# Altium project MB672.PrjPCB (part 1 of 2)
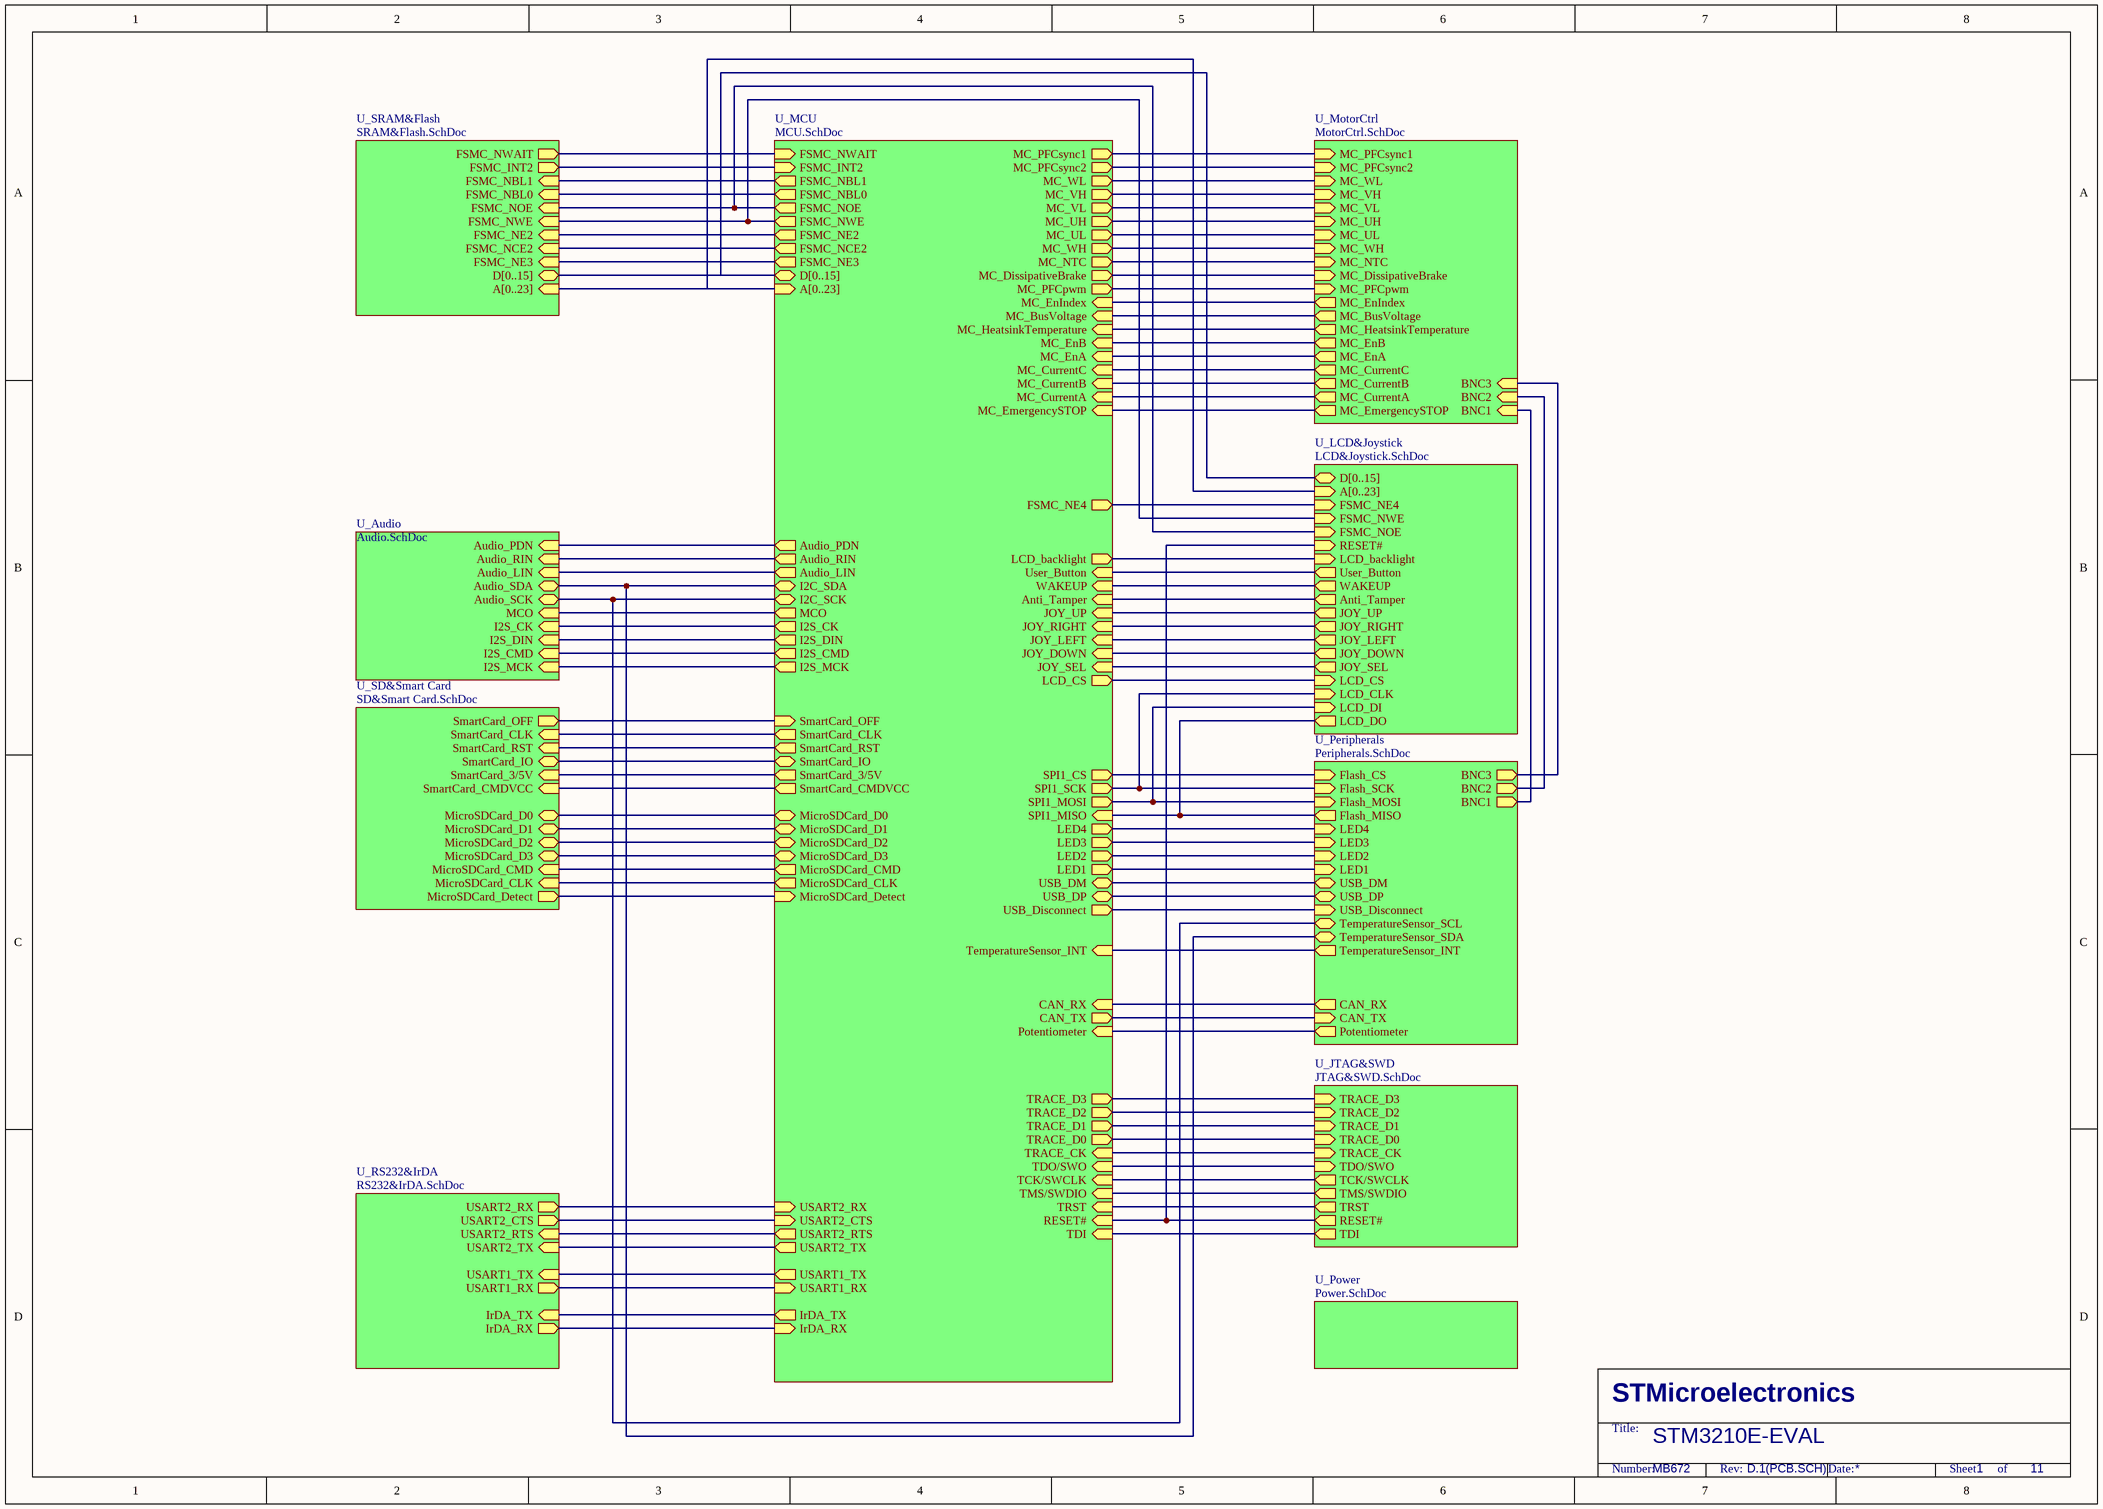
[diagram p0: MB672.SchDoc]
11 sheets, 337 parts. Net scope: hierarchical (ports join the sheet entries above them; power ports are global).
Board file: MB672.PCBDOC
Sheets:
  MB672.SchDoc
    U_Audio = Audio.SchDoc
    U_SRAM&Flash = SRAM&Flash.SchDoc
    U_RS232&IrDA = RS232&IrDA.SchDoc
    U_Peripherals = Peripherals.SchDoc
    U_MotorCtrl = MotorCtrl.SchDoc
    U_Power = Power.SchDoc
    U_JTAG&SWD = JTAG&SWD.SchDoc
    U_MCU = MCU.SchDoc
    U_SD&Smart Card = SD&Smart Card.SchDoc
    U_LCD&Joystick = LCD&Joystick.SchDoc

## Sheet MB672.SchDoc
size A3; Revision: D.1(PCB.SCH)

### Sub-sheets
U_Audio = Audio.SchDoc: I2S_CMD (in), I2S_DIN (in), I2S_CK (in), MCO (in), Audio_SCK (bidir), Audio_SDA (bidir), Audio_LIN (in), Audio_RIN (in), I2S_MCK (in), Audio_PDN (in)
U_JTAG&SWD = JTAG&SWD.SchDoc: TDI (out), RESET# (out), TRACE_D3 (in), TRACE_D2 (in), TRACE_D1 (in), TRACE_D0 (in), TRACE_CK (in), TRST (out), TMS/SWDIO (out), TCK/SWCLK (out), TDO/SWO (in)
U_LCD&Joystick = LCD&Joystick.SchDoc: JOY_SEL (out), JOY_DOWN (out), JOY_LEFT (out), JOY_RIGHT (out), JOY_UP (out), LCD_CS (in), LCD_CLK (in), LCD_DI (in), RESET# (in), LCD_backlight (in), Anti_Tamper (out), WAKEUP (out), User_Button (out), FSMC_NE4 (in), D[0..15] (bidir), A[0..23] (in), FSMC_NWE (in), FSMC_NOE (in), LCD_DO (out)
U_MCU = MCU.SchDoc: TDI (in), TRACE_CK (in), TMS/SWDIO (in), TCK/SWCLK (in), TDO/SWO (in), USART2_RX (in), USART2_TX (out), USART2_RTS (out), USART2_CTS (in), USART1_TX (out), USART1_RX (in), IrDA_RX (in), IrDA_TX (out), MC_EmergencySTOP (in), MC_CurrentA (in), MC_CurrentB (in), MC_CurrentC (in), MC_PFCsync1 (out), MC_PFCsync2 (out), MC_WL (out), MC_VH (out), MC_VL (out), MC_UH (out), MC_UL (out), MC_WH (out), MC_NTC (out), MC_DissipativeBrake (out), MC_PFCpwm (out), MC_EnA (in), MC_EnB (in), MC_HeatsinkTemperature (in), MC_BusVoltage (in), MC_EnIndex (in), JOY_SEL (in), JOY_DOWN (in), JOY_LEFT (in), JOY_RIGHT (in), JOY_UP (in), LCD_CS (out), LCD_backlight (out), Anti_Tamper (in), WAKEUP (in), User_Button (in), SPI1_CS (out), SPI1_SCK (out), SPI1_MISO (in), SPI1_MOSI (out), LED4 (out), LED3 (out), LED1 (out), LED2 (out), USB_DM (bidir), USB_DP (bidir), USB_Disconnect (out), TemperatureSensor_INT (in), CAN_TX (out), CAN_RX (in), Potentiometer (in), FSMC_NE3 (out), A[0..23] (in), D[0..15] (bidir), FSMC_NE4 (out), FSMC_NCE2 (out), FSMC_NE2 (out), FSMC_NWE (out), FSMC_NOE (out), FSMC_NBL0 (out), FSMC_NBL1 (out), FSMC_NWAIT (in), FSMC_INT2 (in), MicroSDCard_CLK (out), MicroSDCard_CMD (out), SmartCard_3/5V (out), SmartCard_IO (bidir), SmartCard_RST (out), SmartCard_CLK (out), SmartCard_OFF (in), SmartCard_CMDVCC (out), MicroSDCard_D0 (bidir), I2S_CMD (out), I2S_DIN (out), I2S_CK (out), MCO (out), I2C_SCK (bidir), I2C_SDA (bidir), MicroSDCard_D1 (bidir), MicroSDCard_D2 (bidir), MicroSDCard_D3 (bidir), RESET# (in), TRACE_D3 (out), TRACE_D2 (out), TRACE_D1 (out), TRACE_D0 (out), TRST (in), Audio_LIN (out), Audio_RIN (out), MicroSDCard_Detect (in), I2S_MCK (out), Audio_PDN (out)
U_MotorCtrl = MotorCtrl.SchDoc: MC_EmergencySTOP (out), MC_CurrentA (out), MC_CurrentB (out), MC_CurrentC (out), MC_PFCsync1 (in), MC_PFCsync2 (in), MC_WL (in), MC_VH (in), MC_VL (in), MC_UH (in), MC_UL (in), MC_WH (in), MC_NTC (in), MC_DissipativeBrake (in), MC_PFCpwm (in), MC_EnA (out), MC_EnB (out), MC_HeatsinkTemperature (out), MC_BusVoltage (out), MC_EnIndex (out), BNC1 (in), BNC2 (in), BNC3 (in)
U_Peripherals = Peripherals.SchDoc: Flash_CS (in), Flash_SCK (in), Flash_MISO (out), Flash_MOSI (in), LED4 (in), LED3 (in), LED1 (in), LED2 (in), USB_DM (bidir), USB_DP (bidir), USB_Disconnect (in), TemperatureSensor_INT (out), TemperatureSensor_SCL (bidir), TemperatureSensor_SDA (bidir), BNC1 (out), CAN_TX (in), CAN_RX (out), Potentiometer (out), BNC2 (out), BNC3 (out)
U_Power = Power.SchDoc: no entries
U_RS232&IrDA = RS232&IrDA.SchDoc: USART2_RX (out), USART2_TX (in), USART2_RTS (in), USART2_CTS (out), USART1_TX (in), USART1_RX (out), IrDA_RX (out), IrDA_TX (in)
U_SD&Smart Card = SD&Smart Card.SchDoc: MicroSDCard_CLK (in), MicroSDCard_CMD (in), SmartCard_3/5V (in), SmartCard_IO (bidir), SmartCard_RST (in), SmartCard_CLK (in), SmartCard_OFF (out), SmartCard_CMDVCC (in), MicroSDCard_D0 (bidir), MicroSDCard_D1 (bidir), MicroSDCard_D2 (bidir), MicroSDCard_D3 (bidir), MicroSDCard_Detect (out)
U_SRAM&Flash = SRAM&Flash.SchDoc: A[0..23] (in), D[0..15] (bidir), FSMC_NE3 (in), FSMC_NCE2 (in), FSMC_NE2 (in), FSMC_NWE (in), FSMC_NOE (in), FSMC_NBL0 (in), FSMC_NBL1 (in), FSMC_NWAIT (out), FSMC_INT2 (out)

### Nets
A19: sheet U_JTAG&SWD/TRACE_D0, sheet U_MCU/TRACE_D0
A20: sheet U_JTAG&SWD/TRACE_D1, sheet U_MCU/TRACE_D1
A21: sheet U_JTAG&SWD/TRACE_D2, sheet U_MCU/TRACE_D2
A22: sheet U_JTAG&SWD/TRACE_D3, sheet U_MCU/TRACE_D3
A23: sheet U_JTAG&SWD/TRACE_CK, sheet U_MCU/TRACE_CK
PA0: sheet U_MCU/WAKEUP, sheet U_LCD&Joystick/WAKEUP
PA1: sheet U_RS232&IrDA/USART2_RTS, sheet U_MotorCtrl/MC_EnB, sheet U_MCU/USART2_RTS, sheet U_MCU/MC_EnB
PA2: sheet U_RS232&IrDA/USART2_TX, sheet U_MotorCtrl/MC_EnIndex, sheet U_MCU/USART2_TX, sheet U_MCU/MC_EnIndex
PA4: sheet U_Audio/Audio_RIN, sheet U_MCU/Audio_RIN
PA5: sheet U_Audio/Audio_LIN, sheet U_Peripherals/Flash_SCK, sheet U_MCU/SPI1_SCK, sheet U_MCU/Audio_LIN, sheet U_LCD&Joystick/LCD_CLK
PA6: sheet U_Peripherals/Flash_MISO, sheet U_MCU/SPI1_MISO, sheet U_LCD&Joystick/LCD_DO
PA7: sheet U_Peripherals/Flash_MOSI, sheet U_MotorCtrl/MC_UL, sheet U_MCU/MC_UL, sheet U_MCU/SPI1_MOSI, sheet U_LCD&Joystick/LCD_DI
PA8: sheet U_Audio/MCO, sheet U_MCU/LCD_backlight, sheet U_MCU/MCO, sheet U_LCD&Joystick/LCD_backlight
PA9: sheet U_RS232&IrDA/USART1_TX, sheet U_MCU/USART1_TX
PA10: sheet U_RS232&IrDA/USART1_RX, sheet U_MCU/USART1_RX
PA11: sheet U_Peripherals/USB_DM, sheet U_MCU/USB_DM
PA12: sheet U_Peripherals/USB_DP, sheet U_MCU/USB_DP
PA13: sheet U_JTAG&SWD/TMS/SWDIO, sheet U_MCU/TMS/SWDIO
PA14: sheet U_JTAG&SWD/TCK/SWCLK, sheet U_MCU/TCK/SWCLK
PA15: sheet U_JTAG&SWD/TDI, sheet U_MCU/TDI
PB0: sheet U_MotorCtrl/MC_VL, sheet U_MCU/MC_VL, sheet U_MCU/SmartCard_3/5V, sheet U_SD&Smart Card/SmartCard_3/5V
PB1: sheet U_MotorCtrl/MC_WL, sheet U_MCU/MC_WL
PB2: sheet U_Peripherals/Flash_CS, sheet U_MCU/SPI1_CS
PB3: sheet U_JTAG&SWD/TDO/SWO, sheet U_MCU/TDO/SWO
PB4: sheet U_MotorCtrl/MC_PFCsync1, sheet U_JTAG&SWD/TRST, sheet U_MCU/MC_PFCsync1, sheet U_MCU/TRST
PB5: sheet U_MotorCtrl/MC_PFCpwm, sheet U_MCU/MC_PFCpwm
PB6: sheet U_Audio/Audio_SCK, sheet U_Peripherals/TemperatureSensor_SCL, sheet U_MCU/I2C_SCK
PB7: sheet U_Audio/Audio_SDA, sheet U_Peripherals/TemperatureSensor_SDA, sheet U_MCU/I2C_SDA
PB8: sheet U_Peripherals/CAN_RX, sheet U_MCU/CAN_RX
PB9: sheet U_Peripherals/CAN_TX, sheet U_MCU/CAN_TX
PB10: sheet U_MCU/SmartCard_IO, sheet U_SD&Smart Card/SmartCard_IO
PB11: sheet U_MCU/SmartCard_RST, sheet U_SD&Smart Card/SmartCard_RST
PB12: sheet U_Audio/I2S_CMD, sheet U_MotorCtrl/MC_NTC, sheet U_MCU/MC_NTC, sheet U_MCU/SmartCard_CLK, sheet U_MCU/I2S_CMD, sheet U_SD&Smart Card/SmartCard_CLK
PB13: sheet U_Audio/I2S_CK, sheet U_MCU/I2S_CK
PB14: sheet U_Peripherals/USB_Disconnect, sheet U_MCU/USB_Disconnect
PB15: sheet U_Audio/I2S_DIN, sheet U_MCU/I2S_DIN
PC0: sheet U_MotorCtrl/MC_BusVoltage, sheet U_MCU/MC_BusVoltage
PC1: sheet U_MotorCtrl/MC_CurrentA, sheet U_MCU/MC_CurrentA
PC2: sheet U_MotorCtrl/MC_CurrentB, sheet U_MCU/MC_CurrentB
PC3: sheet U_MotorCtrl/MC_CurrentC, sheet U_MCU/MC_CurrentC
PC4: sheet U_Peripherals/Potentiometer, sheet U_MCU/Potentiometer
PC5: sheet U_MotorCtrl/MC_HeatsinkTemperature, sheet U_MCU/MC_HeatsinkTemperature
PC6: sheet U_Audio/I2S_MCK, sheet U_MotorCtrl/MC_UH, sheet U_MCU/MC_UH, sheet U_MCU/I2S_MCK
PC7: sheet U_MotorCtrl/MC_VH, sheet U_MCU/MC_VH
PC8: sheet U_MotorCtrl/MC_WH, sheet U_MCU/MC_WH
PC9: sheet U_MCU/MicroSDCard_D1, sheet U_SD&Smart Card/MicroSDCard_D1
PC10: sheet U_RS232&IrDA/IrDA_TX, sheet U_MCU/IrDA_TX, sheet U_MCU/MicroSDCard_D2, sheet U_SD&Smart Card/MicroSDCard_D2
PC11: sheet U_MCU/MicroSDCard_D3, sheet U_SD&Smart Card/MicroSDCard_D3
PC12: sheet U_MCU/MicroSDCard_CLK, sheet U_SD&Smart Card/MicroSDCard_CLK
PC13: sheet U_MCU/Anti_Tamper, sheet U_LCD&Joystick/Anti_Tamper
PD2: sheet U_MotorCtrl/MC_PFCsync2, sheet U_MCU/MC_PFCsync2, sheet U_MCU/MicroSDCard_CMD, sheet U_SD&Smart Card/MicroSDCard_CMD
PD3: sheet U_MCU/JOY_DOWN, sheet U_LCD&Joystick/JOY_DOWN
PD4: sheet U_SRAM&Flash/FSMC_NOE, sheet U_MCU/FSMC_NOE, sheet U_LCD&Joystick/FSMC_NOE
PD5: sheet U_SRAM&Flash/FSMC_NWE, sheet U_MCU/FSMC_NWE, sheet U_LCD&Joystick/FSMC_NWE
PD6: sheet U_SRAM&Flash/FSMC_NWAIT, sheet U_MCU/FSMC_NWAIT
PD7: sheet U_SRAM&Flash/FSMC_NCE2, sheet U_MCU/FSMC_NCE2
PE0: sheet U_SRAM&Flash/FSMC_NBL0, sheet U_MCU/FSMC_NBL0
PE1: sheet U_SRAM&Flash/FSMC_NBL1, sheet U_MCU/FSMC_NBL1
PF6: sheet U_Peripherals/LED1, sheet U_MCU/LED1
PF7: sheet U_Peripherals/LED2, sheet U_MCU/LED2
PF8: sheet U_Peripherals/LED3, sheet U_MCU/LED3
PF9: sheet U_Peripherals/LED4, sheet U_MCU/LED4
PF10: sheet U_MCU/LCD_CS, sheet U_LCD&Joystick/LCD_CS
PF11: sheet U_MCU/MicroSDCard_Detect, sheet U_SD&Smart Card/MicroSDCard_Detect
PG6: sheet U_SRAM&Flash/FSMC_INT2, sheet U_MCU/FSMC_INT2
PG7: sheet U_MCU/JOY_SEL, sheet U_LCD&Joystick/JOY_SEL
PG8: sheet U_MCU/User_Button, sheet U_LCD&Joystick/User_Button
PG9: sheet U_SRAM&Flash/FSMC_NE2, sheet U_MCU/FSMC_NE2
PG10: sheet U_SRAM&Flash/FSMC_NE3, sheet U_MCU/FSMC_NE3
PG11: sheet U_Audio/Audio_PDN, sheet U_MCU/Audio_PDN
PG12: sheet U_MCU/FSMC_NE4, sheet U_LCD&Joystick/FSMC_NE4
PG13: sheet U_MCU/JOY_RIGHT, sheet U_LCD&Joystick/JOY_RIGHT
PG14: sheet U_MCU/JOY_LEFT, sheet U_LCD&Joystick/JOY_LEFT
PG15: sheet U_MCU/JOY_UP, sheet U_LCD&Joystick/JOY_UP
RESET#: sheet U_JTAG&SWD/RESET#, sheet U_MCU/RESET#, sheet U_LCD&Joystick/RESET#
NetC1_2: sheet U_MotorCtrl/MC_EnA, sheet U_MCU/MC_EnA
NetCN1_15: sheet U_Peripherals/BNC1, sheet U_MotorCtrl/BNC1
NetCN1_17: sheet U_Peripherals/BNC2, sheet U_MotorCtrl/BNC2
NetCN1_19: sheet U_Peripherals/BNC3, sheet U_MotorCtrl/BNC3
NetCN1_23: sheet U_MotorCtrl/MC_DissipativeBrake, sheet U_MCU/MC_DissipativeBrake
NetCN13_7: sheet U_MCU/MicroSDCard_D0, sheet U_SD&Smart Card/MicroSDCard_D0
NetJP3_2: sheet U_MotorCtrl/MC_EmergencySTOP, sheet U_MCU/MC_EmergencySTOP
NetJP4_3: sheet U_RS232&IrDA/USART2_CTS, sheet U_MCU/USART2_CTS
NetJP11_2: sheet U_Peripherals/TemperatureSensor_INT, sheet U_MCU/TemperatureSensor_INT
NetJP15_2: sheet U_MCU/SmartCard_CMDVCC, sheet U_SD&Smart Card/SmartCard_CMDVCC
NetJP16_2: sheet U_MCU/SmartCard_OFF, sheet U_SD&Smart Card/SmartCard_OFF
NetJP22_2: sheet U_RS232&IrDA/IrDA_RX, sheet U_MCU/IrDA_RX
NetR29_2: sheet U_RS232&IrDA/USART2_RX, sheet U_MCU/USART2_RX

### Buses and harness runs
bus sheet U_LCD&Joystick/A[0..23] = sheet U_MCU/A[0..23] = sheet U_SRAM&Flash/A[0..23]
bus sheet U_LCD&Joystick/D[0..15] = sheet U_MCU/D[0..15] = sheet U_SRAM&Flash/D[0..15]

### Notes on the sheet
- STM3210E-EVAL
- MB672
- 1
- 11
- STMicroelectronics
- Title:
- Number:
- Rev:
- Date:
- Sheet       of

## Sheet Audio.SchDoc
size A4; Revision: D.1(PCB.SCH)
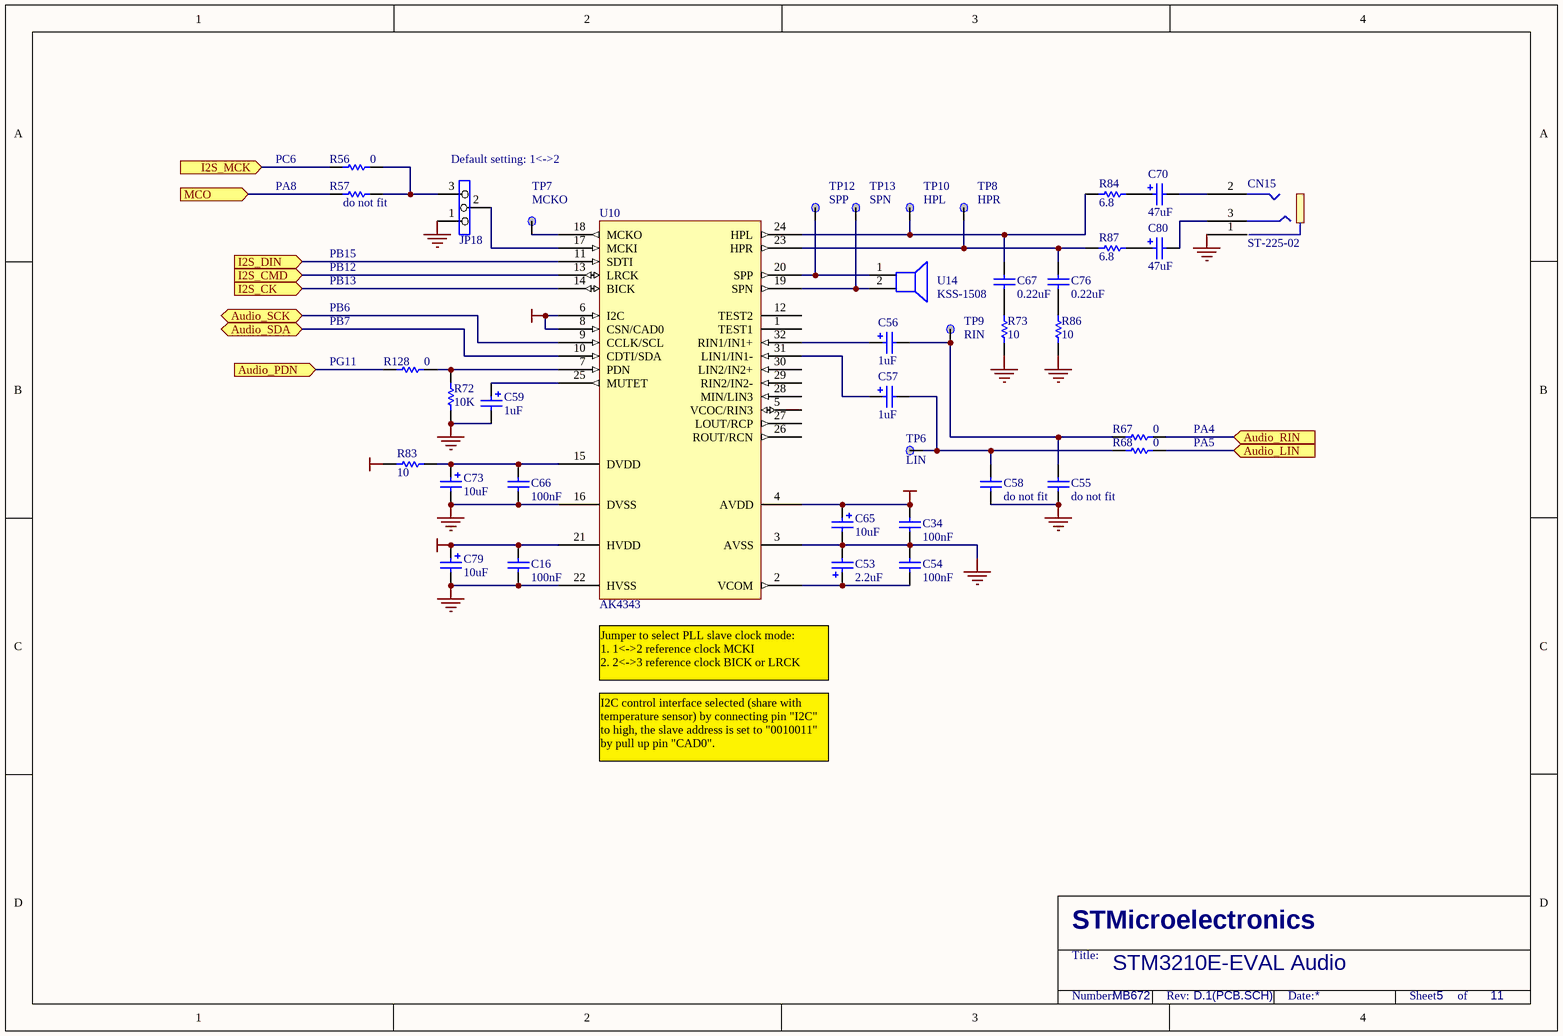
[diagram p1: Audio.SchDoc]

### Parts
C16  100nF  [0603P]
C34  100nF  [0603P]
C53  2.2uF  [C160M]
C54  100nF  [0603P]
C55  do not fit  [0603P]
C56  1uF  [C160M]
C57  1uF  [C160M]
C58  do not fit  [0603P]
C59  1uF  [C160M]
C65  10uF  [C160M]
C66  100nF  [0603P]
C67  0.22uF  [0603P]
C70  47uF  [C160M]
C73  10uF  [C160M]
C76  0.22uF  [0603P]
C79  10uF  [C160M]
C80  47uF  [C160M]
CN15  ST-225-02
JP18  (no value)  [SIP3]
R56  0  [0603]
R57  do not fit  [0603]
R67  0  [0603]
R68  0  [0603]
R72  10K  [0603]
R73  10  [0603]
R83  10  [0603]
R84  6.8  [0603]
R86  10  [0603]
R87  6.8  [0603]
R128  0  [0603]
TP6  LIN  [TP]
TP7  MCKO  [TP]
TP8  HPR  [TP]
TP9  RIN  [TP]
TP10  HPL  [TP]
TP12  SPP  [TP]
TP13  SPN  [TP]
U10  AK4343  [QFN32]
U14  KSS-1508  [KS1508]

### Ports
Audio_LIN (in), Audio_PDN (in), Audio_RIN (in), Audio_SCK (bidir), Audio_SDA (bidir), I2S_CK (in), I2S_CMD (in), I2S_DIN (in), I2S_MCK (in), MCO (in)

### Nets
+3V3: C16.1 C34.2 C65.1 C79.1 R83.2 U10.4(AVDD) U10.6(I2C) U10.8(CSN/CAD0) U10.21(HVDD)
GND: C16.2 C34.1 C53.2 C54.2 C55.1 C58.1 C59.2 C65.2 C66.2 C73.2 C79.2 CN15.1 JP18.1 R72.2 R73.2 R86.2 U10.3(AVSS) U10.16(DVSS) U10.22(HVSS)
PA4: R67.2 ; port Audio_RIN
PA5: R68.2 ; port Audio_LIN
PA8: R57.2 ; port MCO
PB6: U10.9(CCLK/SCL) ; port Audio_SCK
PB7: U10.10(CDTI/SDA) ; port Audio_SDA
PB12: U10.13(LRCK) ; port I2S_CMD
PB13: U10.14(BICK) ; port I2S_CK
PB15: U10.11(SDTI) ; port I2S_DIN
PC6: R56.2 ; port I2S_MCK
PG11: R128.2 ; port Audio_PDN
NetC53_1: C53.1 C54.1 U10.2(VCOM)
NetC55_2: C55.2 C56.2 R67.1 TP9.1
NetC56_1: C56.1 U10.32(RIN1/IN1+)
NetC57_1: C57.1 U10.31(LIN1/IN1-)
NetC57_2: C57.2 C58.2 R68.1 TP6.1
NetC59_1: C59.1 U10.25(MUTET)
NetC66_1: C66.1 C73.1 R83.1 U10.15(DVDD)
NetC67_1: C67.1 R84.2 TP10.1 U10.24(HPL)
NetC67_2: C67.2 R73.1
NetC70_1: C70.1 R84.1
NetC70_2: C70.2 CN15.2
NetC76_1: C76.1 R87.2 TP8.1 U10.23(HPR)
NetC76_2: C76.2 R86.1
NetC80_1: C80.1 R87.1
NetC80_2: C80.2 CN15.3
NetJP18_2: JP18.2 U10.17(MCKI)
NetJP18_3: JP18.3 R56.1 R57.1
NetR72_1: R72.1 R128.1 U10.7(PDN)
NetTP7_1: TP7.1 U10.18(MCKO)
NetTP12_1: TP12.1 U10.20(SPP) U14.1(+)
NetTP13_1: TP13.1 U10.19(SPN) U14.2(-)

Not connected (* = marked no-connect by the designer): U10 1(TEST1) 5(VCOC/RIN3) 12(TEST2) 26(ROUT/RCN) 27(LOUT/RCP) 28(MIN/LIN3) 29(RIN2/IN2-) 30(LIN2/IN2+)

### Notes on the sheet
- PC6
- (near JP18) Default setting: 1<->2
- PA8
- PB12
- PB13
- PB15
- PB6
- PB7
- (near R128) PG11
- PA5
- PA4
- Jumper to select PLL slave clock mode:
  1. 1<->2 reference clock MCKI
  2. 2<->3 reference clock BICK or LRCK
- I2C control interface selected (share with temperature sensor) by connecting pin "I2C" to high, the slave address is set to "0010011"  by pull up pin "CAD0".
- STM3210E-EVAL Audio
- MB672
- 5
- 11
- STMicroelectronics
- Title:
- Number:
- Rev:
- Date:
- Sheet       of

### Library data of the parts
C16 C34 C54 C66 = CAP: Capacitor; Published: 8-Jun-2000; Revision: July-2002: Re-released for DXP Platform.; Publisher: Altium Limited; Value: 100nF
C53 C56 C57 C59 C65 C73 C79 = Cap Pol1: Polarized Capacitor (Radial); Value: 47uF; Published: 8-Jun-2000; Revision: July-2002: Re-released for DXP Platform.; Publisher: Altium Limited
C55 C58 C67 C76 = CAP: Capacitor; Value: 100nF; Published: 8-Jun-2000; Revision: July-2002: Re-released for DXP Platform.; Publisher: Altium Limited
C70 C80 = Cap Pol1: Polarized Capacitor (Radial); Published: 8-Jun-2000; Revision: July-2002: Re-released for DXP Platform.; Publisher: Altium Limited; Value: 47uF
JP18 = Jumper3
R56 R57 R67 R68 R72 R73 R83 R84 R86 R87 R128 = res1: Resistor; Value: 1K; Published: 8-Jun-2000; Revision: July-2002: Re-released for DXP Platform.; Publisher: Altium Limited
TP6-TP10 TP12 TP13 = TP
U14 = Speaker: Loudspeaker; Published: 24-Mar-1999; Revision: July-2002: Re-released for DXP Platform.; Publisher: Altium Limited

## Sheet SRAM&Flash.SchDoc
size A4; Revision: D.1(PCB.SCH)
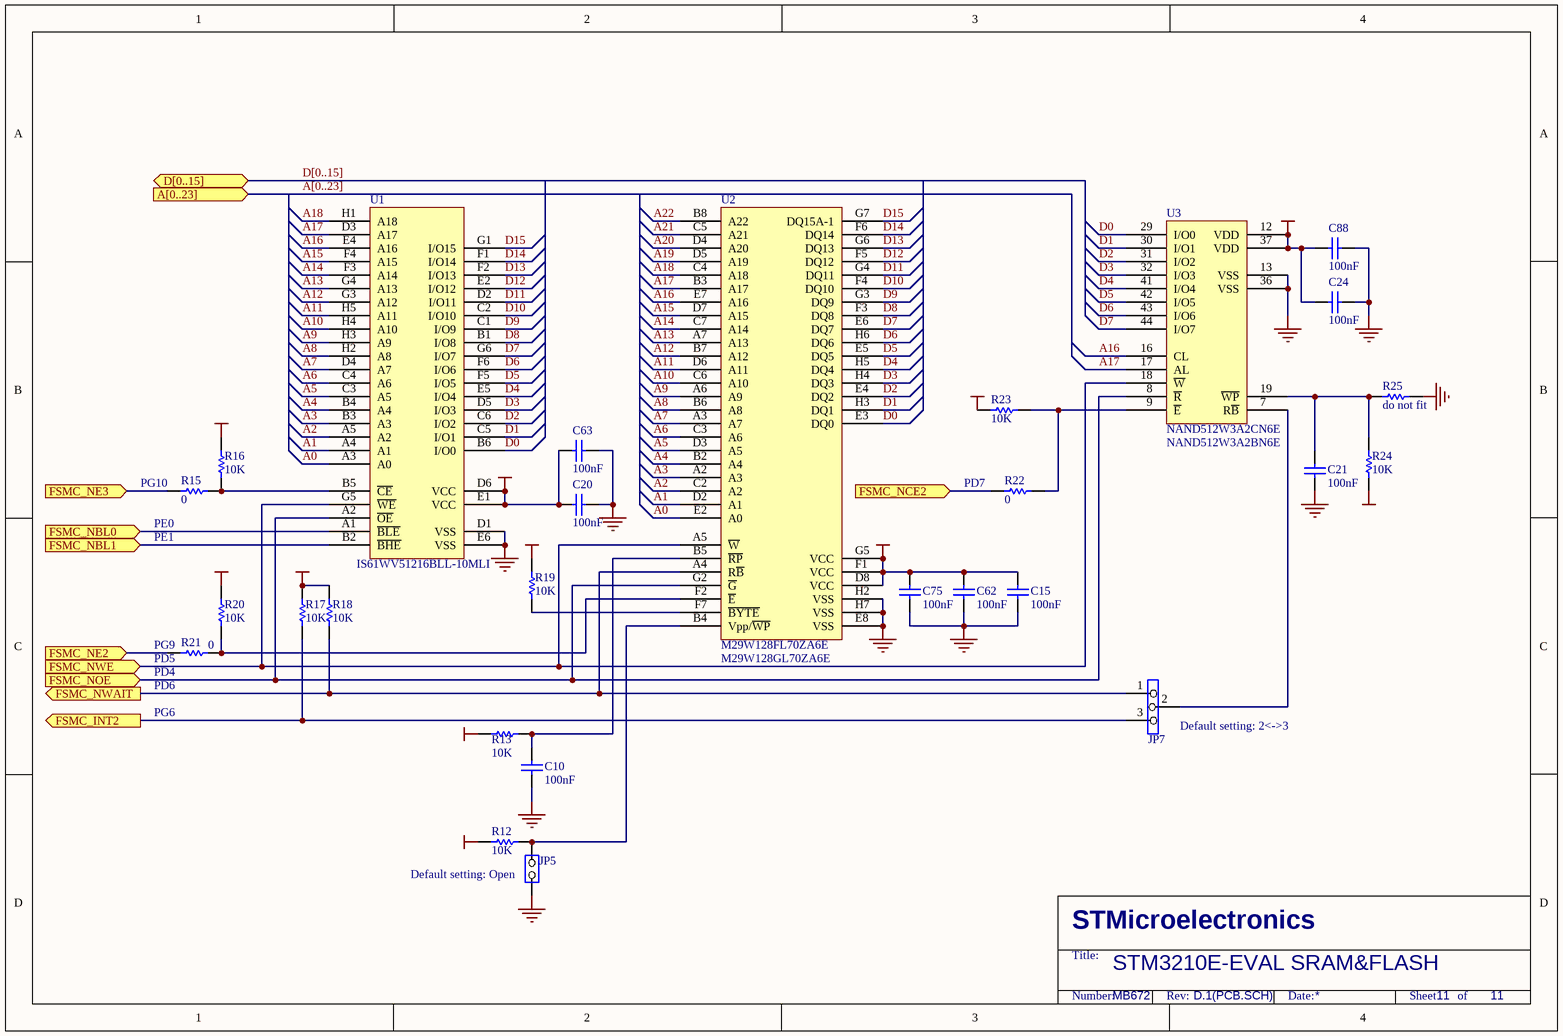
[diagram p2: SRAM&Flash.SchDoc]

### Parts
C10  100nF  [0603]
C15  100nF  [0603]
C20  100nF  [0603]
C21  100nF  [0603]
C24  100nF  [0603]
C62  100nF  [0603]
C63  100nF  [0603]
C75  100nF  [0603]
C88  100nF  [0603]
JP5  (no value)  [SIP2]
JP7  (no value)  [SIP3]
R12  10K  [0603]
R13  10K  [0603]
R15  0  [0603]
R16  10K  [0603]
R17  10K  [0603]
R18  10K  [0603]
R19  10K  [0603]
R20  10K  [0603]
R21  0  [0603]
R22  0  [0603]
R23  10K  [0603]
R24  10K  [0603]
R25  do not fit  [0603]
U1  IS61WV51216BLL-10MLI  [FBGA48]
U2  M29W128FL70ZA6E  [TBGA64(10x13)]
U3  NAND512W3A2CN6E  [TSOP48]

### Ports
A[0..23] (in), D[0..15] (bidir), FSMC_INT2 (out), FSMC_NBL0 (in), FSMC_NBL1 (in), FSMC_NCE2 (in), FSMC_NE2 (in), FSMC_NE3 (in), FSMC_NOE (in), FSMC_NWAIT (out), FSMC_NWE (in)

### Nets
+3V3: C15.2 C20.2 C24.2 C62.2 C63.2 C75.2 C88.2 R12.1 R13.2 R16.1 R17.2 R18.2 R19.1 R20.2 R23.2 R24.1 U1.D6(VCC) U1.E1(VCC) U2.D8(VCC) U2.F1(VCC) U2.G5(VCC) U3.12(VDD) U3.37(VDD)
GND: C10.2 C15.1 C20.1 C21.1 C24.1 C62.1 C63.1 C75.1 C88.1 JP5.1(COMMON) R25.2 U1.D1(VSS) U1.E6(VSS) U2.E8(VSS) U2.H2(VSS) U2.H7(VSS) U3.13(VSS) U3.36(VSS)
A0: U1.A3(A0) U2.E2(A0)
A1: U1.A4(A1) U2.D2(A1)
A2: U1.A5(A2) U2.C2(A2)
A3: U1.B3(A3) U2.A2(A3)
A4: U1.B4(A4) U2.B2(A4)
A5: U1.C3(A5) U2.D3(A5)
A6: U1.C4(A6) U2.C3(A6)
A7: U1.D4(A7) U2.A3(A7)
A8: U1.H2(A8) U2.B6(A8)
A9: U1.H3(A9) U2.A6(A9)
A10: U1.H4(A10) U2.C6(A10)
A11: U1.H5(A11) U2.D6(A11)
A12: U1.G3(A12) U2.B7(A12)
A13: U1.G4(A13) U2.A7(A13)
A14: U1.F3(A14) U2.C7(A14)
A15: U1.F4(A15) U2.D7(A15)
A16: U1.E4(A16) U2.E7(A16) U3.16(CL)
A17: U1.D3(A17) U2.B3(A17) U3.17(AL)
A18: U1.H1(A18) U2.C4(A18)
A19: U2.D5(A19)
A20: U2.D4(A20)
A21: U2.C5(A21)
A22: U2.B8(A22)
D0: U1.B6(I/O0) U2.E3(DQ0) U3.29(I/O0)
D1: U1.C5(I/O1) U2.H3(DQ1) U3.30(I/O1)
D2: U1.C6(I/O2) U2.E4(DQ2) U3.31(I/O2)
D3: U1.D5(I/O3) U2.H4(DQ3) U3.32(I/O3)
D4: U1.E5(I/O4) U2.H5(DQ4) U3.41(I/O4)
D5: U1.F5(I/O5) U2.E5(DQ5) U3.42(I/O5)
D6: U1.F6(I/O6) U2.H6(DQ6) U3.43(I/O6)
D7: U1.G6(I/O7) U2.E6(DQ7) U3.44(I/O7)
D8: U1.B1(I/O8) U2.F3(DQ8)
D9: U1.C1(I/O9) U2.G3(DQ9)
D10: U1.C2(I/O10) U2.F4(DQ10)
D11: U1.D2(I/O11) U2.G4(DQ11)
D12: U1.E2(I/O12) U2.F5(DQ12)
D13: U1.F2(I/O13) U2.G6(DQ13)
D14: U1.F1(I/O14) U2.F6(DQ14)
D15: U1.G1(I/O15) U2.G7(DQ15A-1)
PD4: U1.A2(~{OE}) U2.G2(~{G}) U3.8(~{R}) ; port FSMC_NOE
PD5: U1.G5(~{WE}) U2.A5(~{W}) U3.18(~{W}) ; port FSMC_NWE
PD6: JP7.1 R18.1 U2.A4(R~{B}) ; port FSMC_NWAIT
PD7: R22.1 ; port FSMC_NCE2
PE0: U1.A1(~{BLE}) ; port FSMC_NBL0
PE1: U1.B2(~{BHE}) ; port FSMC_NBL1
PG6: JP7.3 R17.1 ; port FSMC_INT2
PG9: R21.1 ; port FSMC_NE2
PG10: R15.1 ; port FSMC_NE3
NetC10_1: C10.1 R13.1 U2.B5(~{RP})
NetC21_2: C21.2 R24.2 R25.1 U3.19(~{WP})
NetJP5_2: JP5.2(NO) R12.2 U2.B4(Vpp/~{WP})
NetJP7_2: JP7.2 U3.7(R~{B})
NetR15_2: R15.2 R16.2 U1.B5(~{CE})
NetR19_2: R19.2 U2.F7(~{BYTE})
NetR20_1: R20.1 R21.2 U2.F2(~{E})
NetR22_2: R22.2 R23.1 U3.9(~{E})

Not connected (* = marked no-connect by the designer): U3 1(NC) 2(NC) 3(NC) 4(NC) 5(NC) 6(NC) 10(NC) 11(NC) 14(NC) 15(NC) 20(NC) 21(NC) 22(NC) 23(NC) 24(NC) 25(NC) 26(NC) 27(NC) 28(NC) 33(NC) 34(NC) 35(NC) 38(NC) 39(NC) 40(NC) 45(NC) 46(NC) 47(NC) 48(NC)

### Buses and harness runs
bus A[0..23] = port A[0..23]
bus D[0..15] = port D[0..15]

### Notes on the sheet
- (near U3) NAND512W3A2BN6E
- (near R15) PG10
- (near R22) PD7
- (near R15) PE1
- (near R15) PE0
- (near R21) PG9
- (near R21) PD5
- (near R21) PD6
- (near R21) PD4
- PG6
- (near U2) M29W128GL70ZA6E
- (near JP7) Default setting: 2<->3
- (near JP5) Default setting: Open
- STM3210E-EVAL SRAM&FLASH
- MB672
- 11
- STMicroelectronics
- Title:
- Number:
- Rev:
- Date:
- Sheet       of

### Library data of the parts
C10 C15 C20 C21 C24 C62 C63 C75 C88 = cap: Capacitor; Value: 100pF; Published: 8-Jun-2000; Revision: July-2002: Re-released for DXP Platform.; Publisher: Altium Limited
JP5 = JP2
JP7 = Jumper3
R12 R13 R15-R25 = Res1: Resistor; Value: 1K; Published: 8-Jun-2000; Revision: July-2002: Re-released for DXP Platform.; Publisher: Altium Limited
U1 = IS64WV51216BLL-10MA3
U3 = NAND01GW3B2BN: 1G/8bits/3.3V/large page/

## Sheet RS232&IrDA.SchDoc
size A4; Revision: D.1(PCB.SCH)
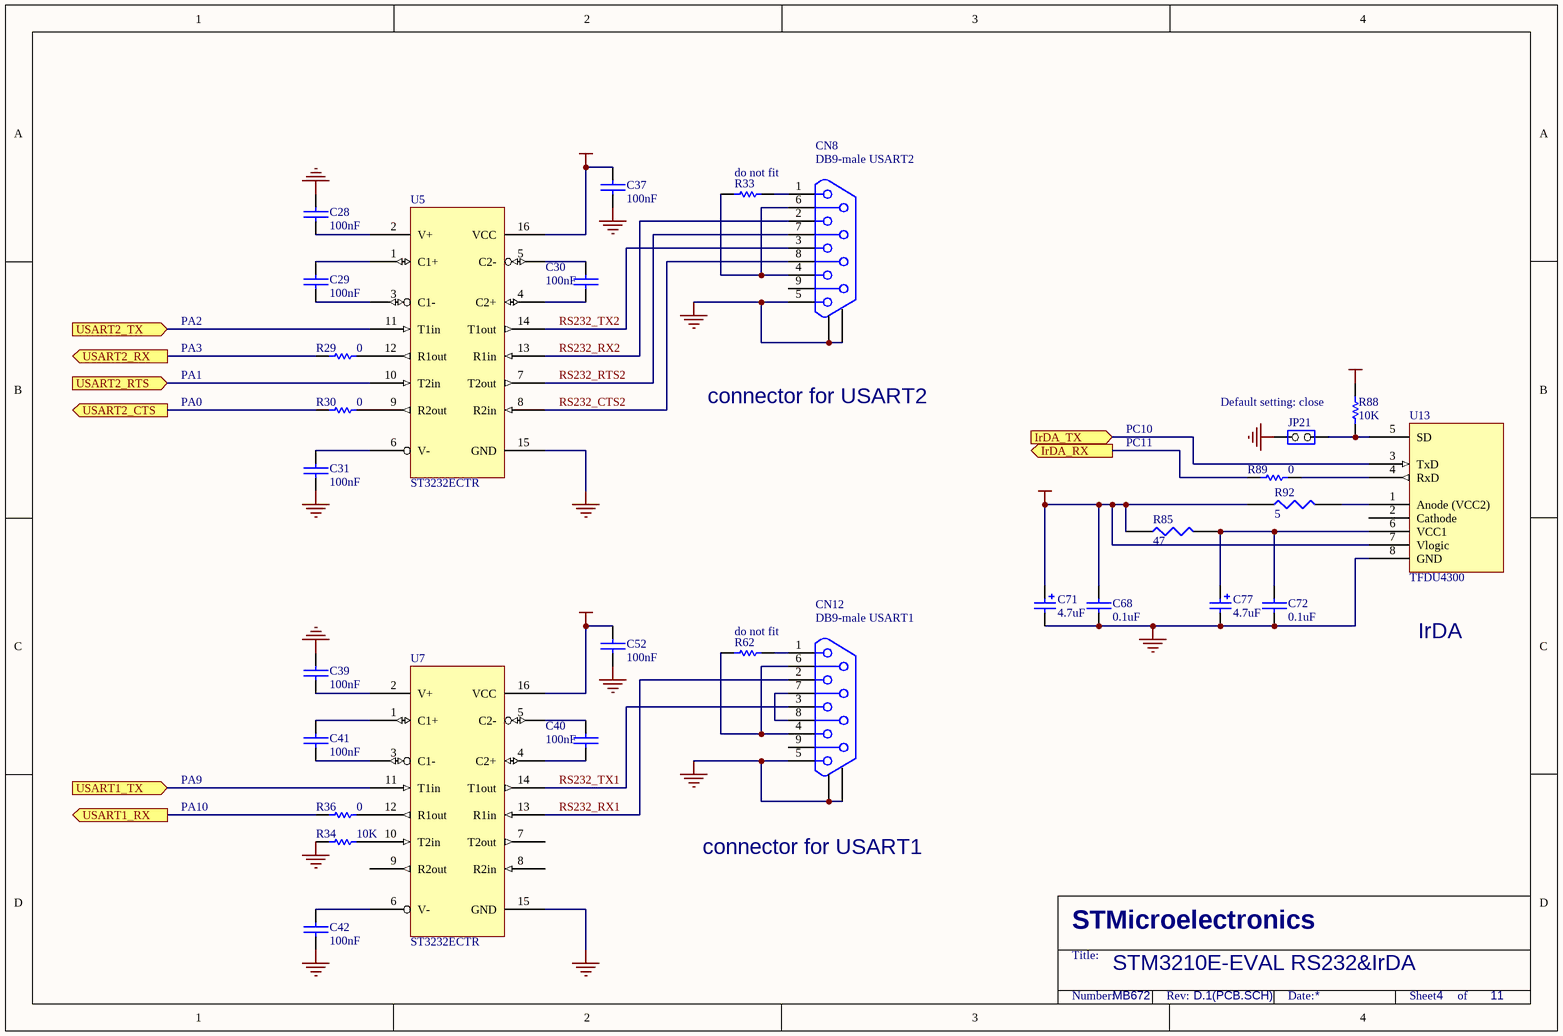
[diagram p3: RS232&IrDA.SchDoc]

### Parts
C28  100nF  [0603P]
C29  100nF  [0603P]
C30  100nF  [0603P]
C31  100nF  [0603P]
C37  100nF  [0603P]
C39  100nF  [0603P]
C40  100nF  [0603P]
C41  100nF  [0603P]
C42  100nF  [0603P]
C52  100nF  [0603P]
C68  0.1uF  [0603P]
C71  4.7uF  [TAN-B]
C72  0.1uF  [0603P]
C77  4.7uF  [TAN-B]
CN8  DB9-male USART2  [DB9/M]
CN12  DB9-male USART1  [DB9/M]
JP21  (no value)  [SIP2]
R29  0  [0805]
R30  0  [0805]
R33  do not fit  [0603_NC]
R34  10K  [0603]
R36  0  [0805]
R62  do not fit  [0603_NC]
R85  47  [0603]
R88  10K  [0603]
R89  0  [0805]
R92  5  [0603]
U5  ST3232ECTR  [TSSOP16]
U7  ST3232ECTR  [TSSOP16]
U13  TFDU4300  [IR_VISHAY3]

### Ports
IrDA_RX (out), IrDA_TX (in), USART1_RX (out), USART1_TX (in), USART2_CTS (out), USART2_RTS (in), USART2_RX (out), USART2_TX (in)

### Nets
+3V3: C37.1 C52.1 C68.1 C71.1 R85.1 R88.2 R92.1 U5.16(VCC) U7.16(VCC) U13.7(Vlogic)
GND: C28.1 C31.1 C37.2 C39.1 C42.1 C52.2 C68.2 C71.2 C72.2 C77.2 CN8.0 CN8.5 CN12.0 CN12.5 JP21.2(NO) R34.2 U5.15(GND) U7.15(GND) U13.8(GND)
PA1: U5.10(T2in) ; port USART2_RTS
PA2: U5.11(T1in) ; port USART2_TX
PA9: U7.11(T1in) ; port USART1_TX
PA10: R36.2 ; port USART1_RX
PC10: U13.3(TxD) ; port IrDA_TX
RS232_CTS2: CN8.8 U5.8(R2in)
RS232_RTS2: CN8.7 U5.7(T2out)
RS232_RX1: CN12.2 U7.13(R1in)
RS232_RX2: CN8.2 U5.13(R1in)
RS232_TX1: CN12.3 U7.14(T1out)
RS232_TX2: CN8.3 U5.14(T1out)
NetC28_2: C28.2 U5.2(V+)
NetC29_1: C29.1 U5.1(C1+)
NetC29_2: C29.2 U5.3(C1-)
NetC30_1: C30.1 U5.4(C2+)
NetC30_2: C30.2 U5.5(C2-)
NetC31_2: C31.2 U5.6(V-)
NetC39_2: C39.2 U7.2(V+)
NetC40_1: C40.1 U7.4(C2+)
NetC40_2: C40.2 U7.5(C2-)
NetC41_1: C41.1 U7.1(C1+)
NetC41_2: C41.2 U7.3(C1-)
NetC42_2: C42.2 U7.6(V-)
NetC72_1: C72.1 C77.1 R85.2 U13.6(VCC1)
NetCN8_1: CN8.1 R33.2
NetCN8_4: CN8.4 CN8.6 R33.1
NetCN12_1: CN12.1 R62.2
NetCN12_4: CN12.4 CN12.6 R62.1
NetCN12_7: CN12.7 CN12.8
NetJP4_3: R30.2 ; port USART2_CTS
NetJP21_1: JP21.1(COMMON) R88.1 U13.5(SD)
NetJP22_2: R89.2 ; port IrDA_RX
NetR29_1: R29.1 U5.12(R1out)
NetR29_2: R29.2 ; port USART2_RX
NetR30_1: R30.1 U5.9(R2out)
NetR34_1: R34.1 U7.10(T2in)
NetR36_1: R36.1 U7.12(R1out)
NetR89_1: R89.1 U13.4(RxD)
NetR92_2: R92.2 U13.1(Anode_(VCC2))

Not connected (* = marked no-connect by the designer): CN8 9; CN12 9; U7 7(T2out) 8(R2in) 9(R2out); U13 2(Cathode)

### Notes on the sheet
- PA1
- PA2
- PA3
- PA0
- connector for USART2
- PC10
- PC11
- (near R88) Default setting: close
- IrDA
- PA9
- PA10
- connector for USART1
- STM3210E-EVAL RS232&IrDA
- MB672
- 4
- 11
- STMicroelectronics
- Title:
- Number:
- Rev:
- Date:
- Sheet       of

### Library data of the parts
C28-C31 C37 C39-C42 C52 C68 C72 = CAP: Capacitor
C71 C77 = Cap Pol1: Polarized Capacitor (Radial); Value: 100pF; Published: 8-Jun-2000; Revision: July-2002: Re-released for DXP Platform.; Publisher: Altium Limited
CN8 CN12 = DB9
JP21 = JP2
R29 R30 R34 R36 R88 R89 = Res1: Resistor; Value: 1K; Published: 8-Jun-2000; Revision: July-2002: Re-released for DXP Platform.; Publisher: Altium Limited
R33 R62 = res1: Resistor; Value: 1K; Published: 8-Jun-2000; Revision: July-2002: Re-released for DXP Platform.; Publisher: Altium Limited
R85 R92 = RES1
U5 U7 = ST3232: 3.3V/5V Dual RS232 Transceiver w/ Int. Cap.

## Sheet Peripherals.SchDoc
size A4; Revision: D.1(PCB.SCH)
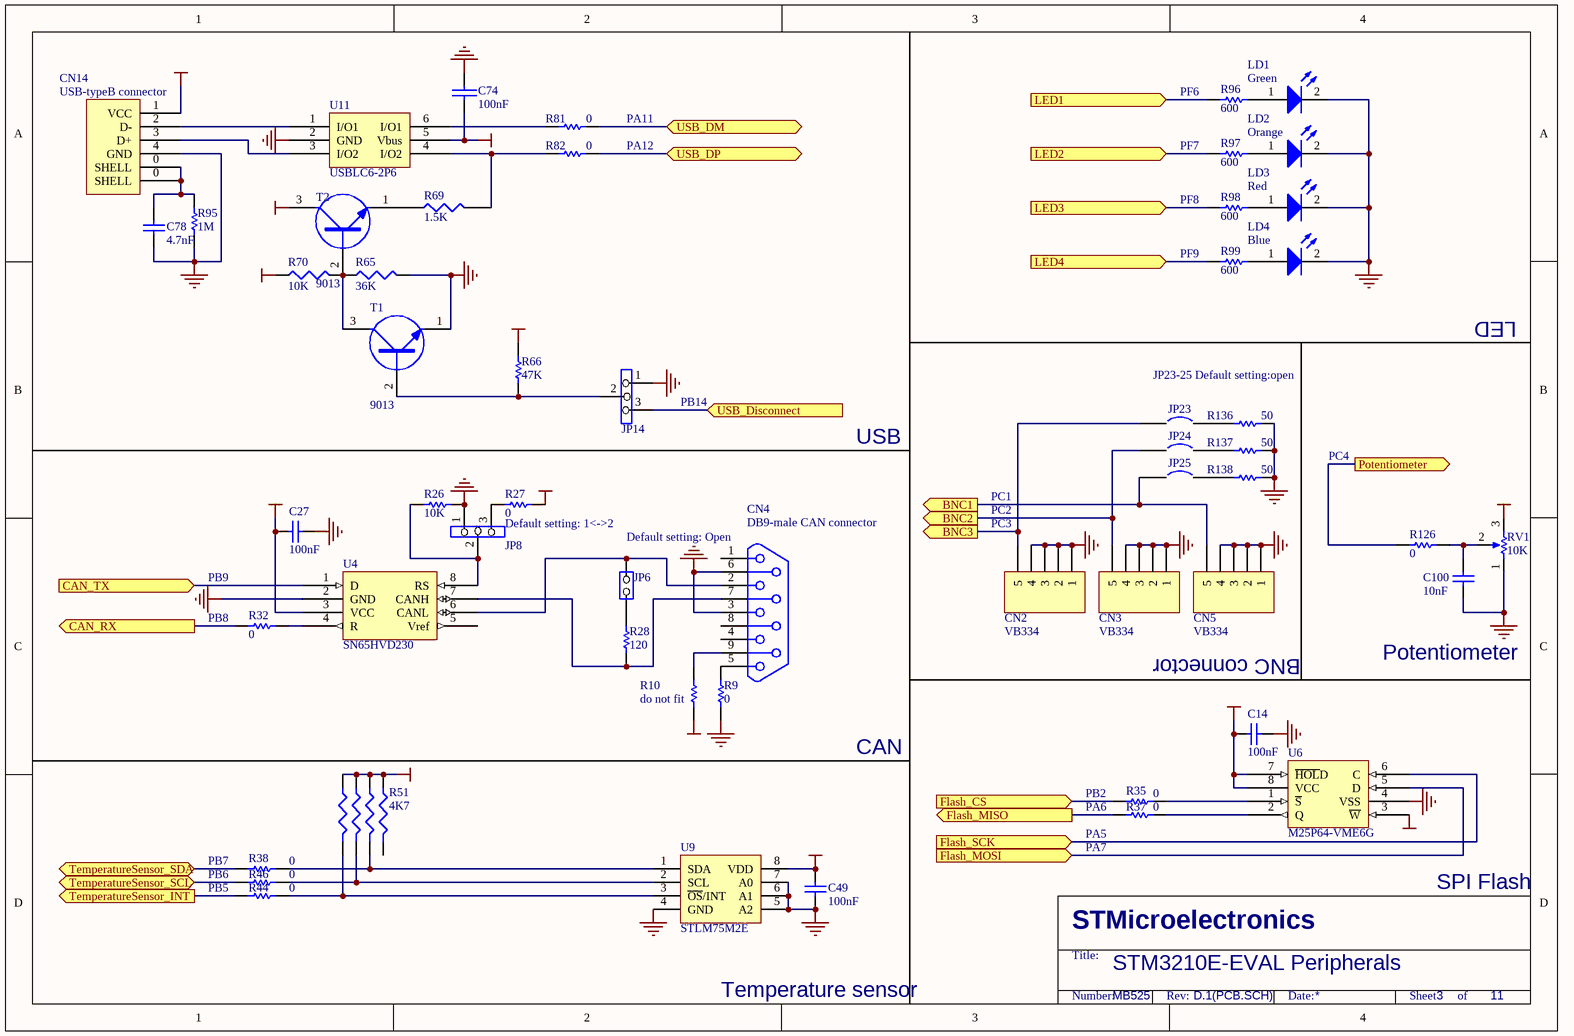
[diagram p4: Peripherals.SchDoc]

### Parts
C14  100nF  [0603P]
C27  100nF  [0603P]
C49  100nF  [0603P]
C74  100nF  [0603P]
C78  4.7nF  [0603]
C100  10nF  [0603]
CN2  VB334  [VB334]
CN3  VB334  [VB334]
CN4  DB9-male CAN connector  [DB9/M]
CN5  VB334  [VB334]
CN14  USB-typeB connector  [USB-B]
JP6  (no value)  [SIP2]
JP8  (no value)  [SIP3]
JP14  (no value)  [SIP3]
JP23  (no value)  [SPST-2]
JP24  (no value)  [SPST-2]
JP25  (no value)  [SPST-2]
LD1  Green  [D0603]
LD2  Orange  [D0603]
LD3  Red  [D0603]
LD4  Blue  [D0603]
R9  0  [0603]
R10  do not fit  [0603]
R26  10K  [0603]
R27  0  [0603]
R28  120  [0603]
R32  0  [0805]
R35  0  [0805]
R37  0  [0805]
R38  0  [0805]
R44  0  [0805]
R46  0  [0805]
R51  4K7  [RES4B]
R65  36K  [0603]
R66  47K  [0603]
R69  1.5K  [0603]
R70  10K  [0603]
R81  0  [0603]
R82  0  [0603]
R95  1M  [0603]
R96  600  [0805]
R97  600  [0805]
R98  600  [0805]
R99  600  [0805]
R126  0  [0805]
R136  50  [0603]
R137  50  [0603]
R138  50  [0603]
RV1  10K  [ADJRH]
T1  9013  [SOT-23]
T2  9013  [SOT-23]
U4  SN65HVD230  [SO8]
U6  M25P64-VME6G  [VDFPN8(8*6)]
U9  STLM75M2E  [SO8]
U11  USBLC6-2P6  [SOT-666]

### Ports
BNC1 (out), BNC2 (out), BNC3 (out), CAN_RX (out), CAN_TX (in), Flash_CS (in), Flash_MISO (out), Flash_MOSI (in), Flash_SCK (in), LED1 (in), LED2 (in), LED3 (in), LED4 (in), Potentiometer (out), TemperatureSensor_INT (out), TemperatureSensor_SCL (bidir), TemperatureSensor_SDA (bidir), USB_Disconnect (in), USB_DM (bidir), USB_DP (bidir)

### Nets
+3V3: C14.2 C27.2 C49.2 R10.1 R27.2 R51.1(R0) R51.3(R2) R51.5(R3) R51.7(R1) R66.2 RV1.3(TOP) T2.3(C) U4.3(VCC) U6.3(~{W}) U6.7(~{HOL}D) U6.8(VCC) U9.8(VDD)
GND: C14.1 C27.1 C49.1 C74.1 C78.1 C100.1 CN2.1 CN2.2 CN2.3 CN2.4 CN3.1 CN3.2 CN3.3 CN3.4 CN4.3 CN4.6 CN5.1 CN5.2 CN5.3 CN5.4 CN14.4(GND) JP8.1 JP14.1 LD1.2(K) LD2.2(K) LD3.2(K) LD4.2(K) R9.1 R26.2 R65.2 R95.1 R136.2 R137.2 R138.2 RV1.1(BOT) T1.1(E) U4.2(GND) U6.4(VSS) U9.4(GND) U9.5(A2) U9.6(A1) U9.7(A0) U11.2(GND)
U5V: C74.2 CN14.1(VCC) R70.1 U11.5(Vbus)
PA5: U6.6(C) ; port Flash_SCK
PA6: R37.1 ; port Flash_MISO
PA7: U6.5(D) ; port Flash_MOSI
PA11: R81.1 ; port USB_DM
PA12: R82.1 ; port USB_DP
PB2: R35.2 ; port Flash_CS
PB6: R44.2 ; port TemperatureSensor_SCL
PB7: R38.2 ; port TemperatureSensor_SDA
PB8: R32.2 ; port CAN_RX
PB9: U4.1(D) ; port CAN_TX
PB14: JP14.3 ; port USB_Disconnect
PC4: R126.1 ; port Potentiometer
PF6: R96.2 ; port LED1
PF7: R97.2 ; port LED2
PF8: R98.2 ; port LED3
PF9: R99.2 ; port LED4
NetC78_2: C78.2 CN14.0(SHELL) R95.2
NetC100_2: C100.2 R126.2 RV1.2(TAP)
NetCN1_15: CN5.5 JP25.1 ; port BNC1
NetCN1_17: CN3.5 JP24.1 ; port BNC2
NetCN1_19: CN2.5 JP23.1 ; port BNC3
NetCN4_2: CN4.2 JP6.2(NO) U4.6(CANL)
NetCN4_5: CN4.5 R9.2
NetCN4_7: CN4.7 R28.1 U4.7(CANH)
NetCN4_9: CN4.9 R10.2
NetCN14_2: CN14.2(D-) U11.1(I/O1)
NetCN14_3: CN14.3(D+) U11.3(I/O2)
NetJP6_1: JP6.1(COMMON) R28.2
NetJP8_2: JP8.2 R26.1 U4.8(RS)
NetJP8_3: JP8.3 R27.1
NetJP11_2: R46.2 ; port TemperatureSensor_INT
NetJP14_2: JP14.2 R66.1 T1.2(B)
NetJP23_2: JP23.2 R136.1
NetJP24_2: JP24.2 R137.1
NetJP25_2: JP25.2 R138.1
NetLD1_1: LD1.1(A) R96.1
NetLD2_1: LD2.1(A) R97.1
NetLD3_1: LD3.1(A) R98.1
NetLD4_1: LD4.1(A) R99.1
NetR32_1: R32.1 U4.4(R)
NetR35_1: R35.1 U6.1(~{S})
NetR37_2: R37.2 U6.2(Q)
NetR38_1: R38.1 R51.4(R3) U9.1(SDA)
NetR44_1: R44.1 R51.6(R2) U9.2(SCL)
NetR46_1: R46.1 R51.8(R0) U9.3(~{OS}/INT)
NetR65_1: R65.1 R70.2 T1.3(C) T2.2(B)
NetR69_1: R69.1 T2.1(E)
NetR69_2: R69.2 R82.2 U11.4(I/O2)
NetR81_2: R81.2 U11.6(I/O1)

Not connected (* = marked no-connect by the designer): CN4 1 4 8; R51 2(R1); U4 5(Vref)

### Notes on the sheet
- (near R96) PF6
- PA12
- PA11
- (near R97) PF7
- (near R98) PF8
- (near R99) PF9
- LED
- JP23-25 Default setting:open
- (near JP14) PB14
- USB
- PC2
- PC1
- PC4
- (near R32) PB9
- Default setting: 1<->2
- (near CN4) Default setting: Open
- (near CN2) PC3
- (near R32) PB8
- BNC connector
- Potentiometer
- CAN
- PB2
- PA6
- PA5
- PA7
- PB6
- PB7
- PB5
- SPI Flash
- STM3210E-EVAL Peripherals
- Temperature sensor
- MB525
- 3
- 11
- STMicroelectronics
- Title:
- Number:
- Rev:
- Date:
- Sheet       of

### Library data of the parts
C14 C27 C74 = CAP: Capacitor
  C14 C27: Published: 8-Jun-2000; Revision: July-2002: Re-released for DXP Platform.; Publisher: Altium Limited; Value: 100nF
C49 = cap: Capacitor; Value: 100pF; Published: 8-Jun-2000; Revision: July-2002: Re-released for DXP Platform.; Publisher: Altium Limited
C78 C100 = CAP: Capacitor; Value: 100pF; Published: 8-Jun-2000; Revision: July-2002: Re-released for DXP Platform.; Publisher: Altium Limited
CN2 CN3 CN5 = Header 5: Header, 5-Pin; Revision: 17-Jul-2002: Re-released for DXP Platform.; Publisher: Altium Limited
CN4 = DB9
CN14 = USB-B
JP6 = JP2
JP8 JP14 = Jumper3
JP23-JP25 = Circuit Breaker: Published: 24-Mar-1999; Revision: July-2002: Re-released for DXP Platform.; Publisher: Altium Limited
LD1-LD4 = LED2: Typical RED, GREEN, YELLOW, AMBER GaAs LED; Published: 8-Jun-2000; Revision: July-2002: Re-released for DXP Platform.; Publisher: Altium Limited
R9 R10 R26-R28 = res1: Resistor; Value: 1K; Published: 8-Jun-2000; Revision: July-2002: Re-released for DXP Platform.; Publisher: Altium Limited
R32 R35 R37 R38 R44 R46 R66 R81 R82 R95-R99 R126 R136-R138 = Res1: Resistor; Value: 1K; Published: 8-Jun-2000; Revision: July-2002: Re-released for DXP Platform.; Publisher: Altium Limited
R51 = RES4B
R65 R70 = R: Right: 20; Bottom: 30
R69 = RES1
RV1 = RV
T1 T2 = NPN
U4 = SN65HVD230D
U9 = STLM75DW2F
U11 = USBLC6-2

## Sheet MotorCtrl.SchDoc
size A4; Revision: D.1(PCB.SCH)
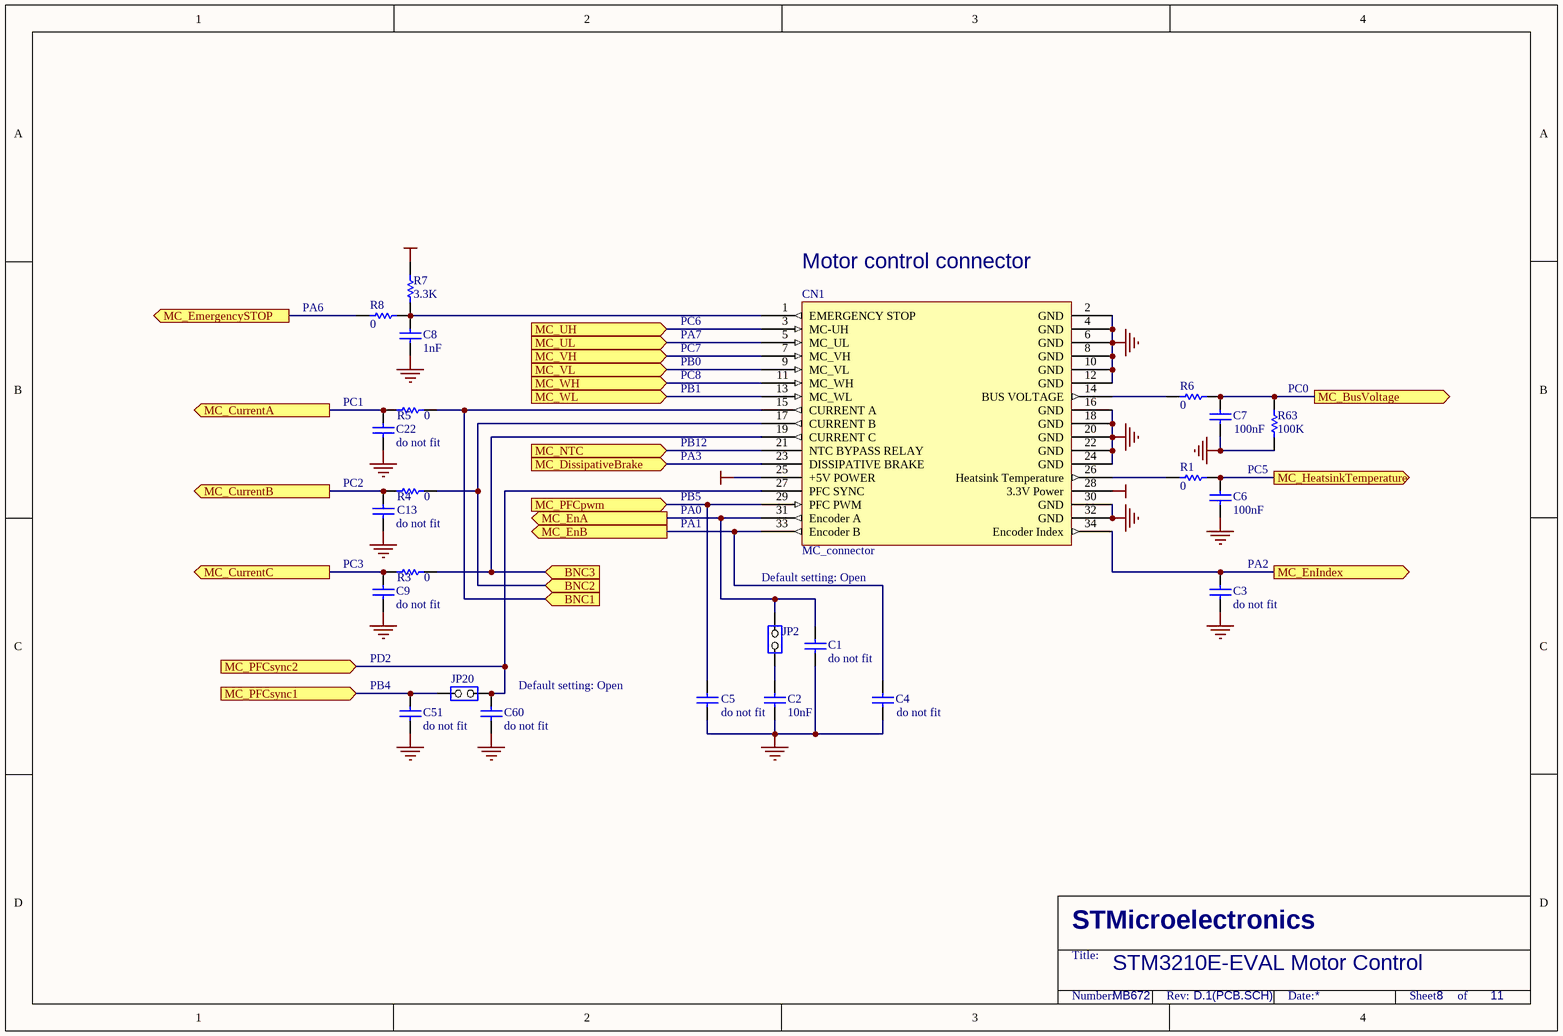
[diagram p5: MotorCtrl.SchDoc]

### Parts
C1  do not fit  [0603]
C2  10nF  [0603]
C3  do not fit  [0603]
C4  do not fit  [0603]
C5  do not fit  [0603]
C6  100nF  [0603]
C7  100nF  [0603]
C8  1nF  [0603]
C9  do not fit  [0603]
C13  do not fit  [0603]
C22  do not fit  [0603]
C51  do not fit  [0603]
C60  do not fit  [0603]
CN1  MC_connector  [IDC34S]
JP2  (no value)  [SIP2]
JP20  (no value)  [SIP2]
R1  0  [0603]
R3  0  [0603]
R4  0  [0603]
R5  0  [0603]
R6  0  [0603]
R7  3.3K  [0603]
R8  0  [0805]
R63  100K  [0603]

### Ports
BNC1 (in), BNC2 (in), BNC3 (in), MC_BusVoltage (out), MC_CurrentA (out), MC_CurrentB (out), MC_CurrentC (out), MC_DissipativeBrake (in), MC_EmergencySTOP (out), MC_EnA (out), MC_EnB (out), MC_EnIndex (out), MC_HeatsinkTemperature (out), MC_NTC (in), MC_PFCpwm (in), MC_PFCsync1 (in), MC_PFCsync2 (in), MC_UH (in), MC_UL (in), MC_VH (in), MC_VL (in), MC_WH (in), MC_WL (in)

### Nets
+3V3: CN1.28(3.3V_Power) R7.2
+5V: CN1.25(+5V_POWER)
GND: C1.1 C2.1 C3.1 C4.1 C5.1 C6.1 C7.1 C8.1 C9.1 C13.1 C22.1 C51.1 C60.1 CN1.2(GND) CN1.4(GND) CN1.6(GND) CN1.8(GND) CN1.10(GND) CN1.12(GND) CN1.16(GND) CN1.18(GND) CN1.20(GND) CN1.22(GND) CN1.24(GND) CN1.30(GND) CN1.32(GND) R63.1
PA1: C4.2 CN1.33(Encoder_B) ; port MC_EnB
PA2: C3.2 CN1.34(Encoder_Index) ; port MC_EnIndex
PA7: CN1.5(MC_UL) ; port MC_UL
PB0: CN1.9(MC_VL) ; port MC_VL
PB1: CN1.13(MC_WL) ; port MC_WL
PB4: C51.2 JP20.2(NO) ; port MC_PFCsync1
PB5: C5.2 CN1.29(PFC_PWM) ; port MC_PFCpwm
PB12: CN1.21(NTC_BYPASS_RELAY) ; port MC_NTC
PC0: C7.2 R6.2 R63.2 ; port MC_BusVoltage
PC1: C22.2 R5.1 ; port MC_CurrentA
PC2: C13.2 R4.1 ; port MC_CurrentB
PC3: C9.2 R3.1 ; port MC_CurrentC
PC5: C6.2 R1.2 ; port MC_HeatsinkTemperature
PC6: CN1.3(MC-UH) ; port MC_UH
PC7: CN1.7(MC_VH) ; port MC_VH
PC8: CN1.11(MC_WH) ; port MC_WH
PD2: C60.2 CN1.27(PFC_SYNC) JP20.1(COMMON) ; port MC_PFCsync2
NetC1_2: C1.2 CN1.31(Encoder_A) JP2.1(COMMON) ; port MC_EnA
NetC2_2: C2.2 JP2.2(NO)
NetC8_2: C8.2 CN1.1(EMERGENCY_STOP) R7.1 R8.1
NetCN1_14: CN1.14(BUS_VOLTAGE) R6.1
NetCN1_15: CN1.15(CURRENT_A) R5.2 ; port BNC1
NetCN1_17: CN1.17(CURRENT_B) R4.2 ; port BNC2
NetCN1_19: CN1.19(CURRENT_C) R3.2 ; port BNC3
NetCN1_23: CN1.23(DISSIPATIVE_BRAKE) ; port MC_DissipativeBrake
NetCN1_26: CN1.26(Heatsink_Temperature) R1.1
NetJP3_2: R8.2 ; port MC_EmergencySTOP

### Notes on the sheet
- (near R8) PA6
- (near CN1) Motor control connector
- PC6
- PA7
- PC7
- PB0
- PC8
- PC1
- PB1
- PB12
- (near R63) PC0
- PC2
- PA3
- PA0
- PB5
- PC5
- PC3
- PA1
- Default setting: Open
- (near C3) PA2
- (near C51) PB4
- PD2
- (near C60) Default setting: Open
- STM3210E-EVAL Motor Control
- MB672
- 8
- 11
- STMicroelectronics
- Title:
- Number:
- Rev:
- Date:
- Sheet       of

### Library data of the parts
C1-C7 C9 C13 C22 C51 C60 = cap: Capacitor; Value: 100pF; Published: 8-Jun-2000; Revision: July-2002: Re-released for DXP Platform.; Publisher: Altium Limited
C8 = CAP: Capacitor; Value: 100pF; Published: 8-Jun-2000; Revision: July-2002: Re-released for DXP Platform.; Publisher: Altium Limited
JP2 JP20 = JP2
R1 R3-R8 R63 = Res1: Resistor; Value: 1K; Published: 8-Jun-2000; Revision: July-2002: Re-released for DXP Platform.; Publisher: Altium Limited

## Sheet Power.SchDoc
size A4; Revision: D.1(PCB.SCH)
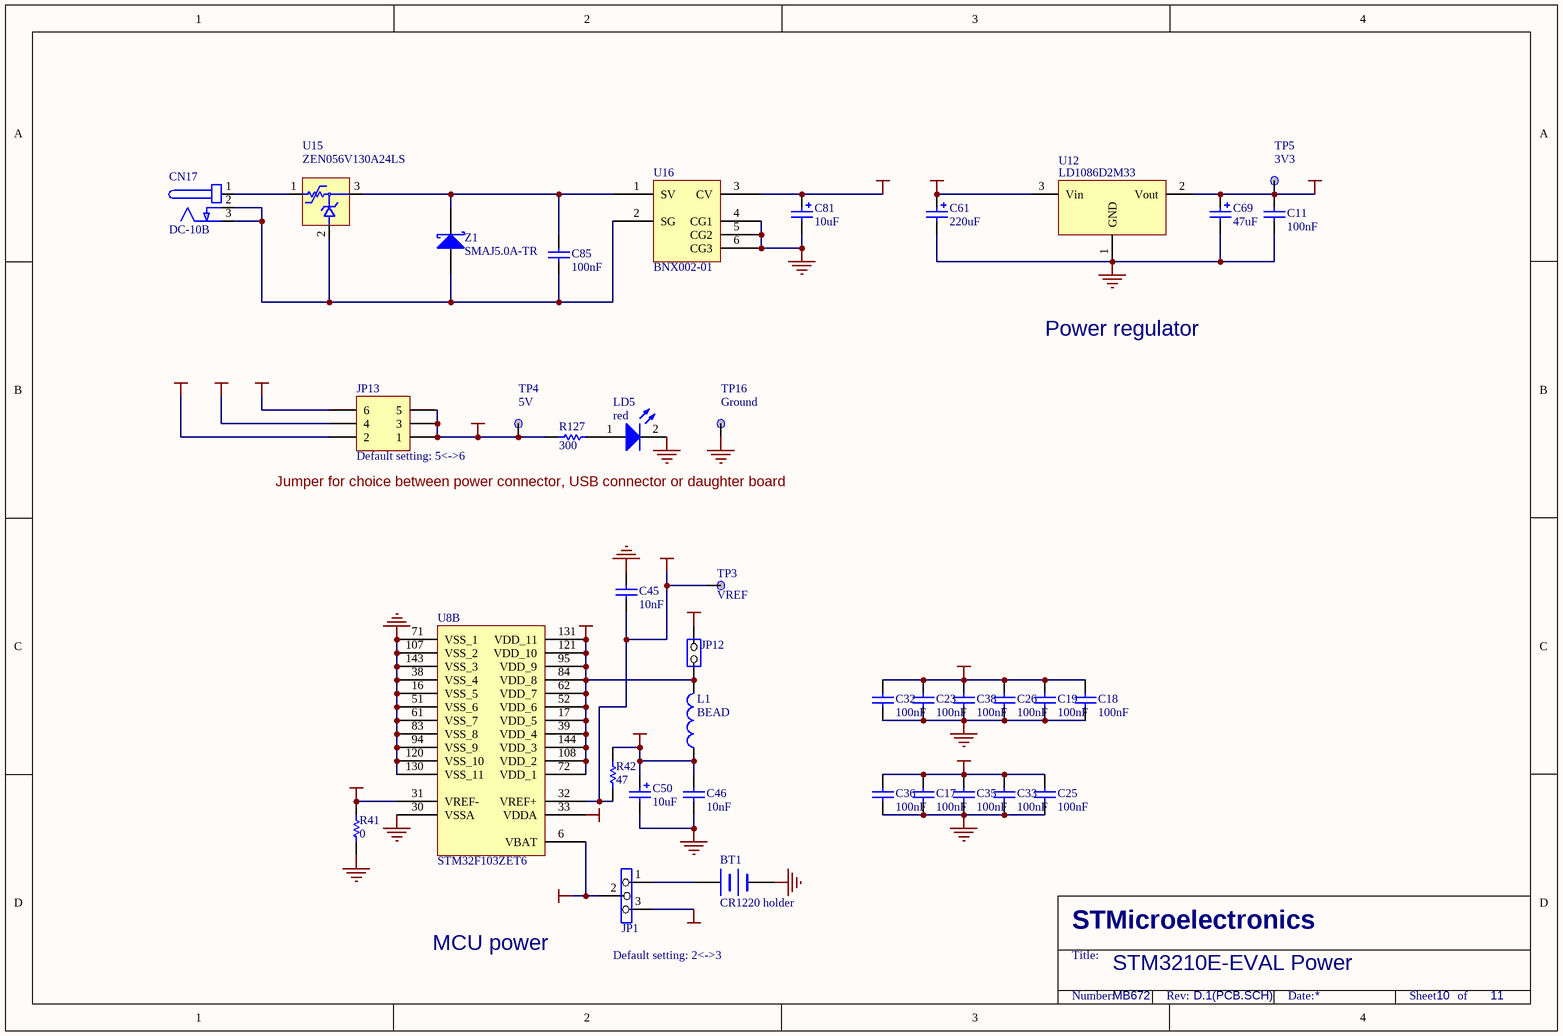
[diagram p6: Power.SchDoc]

### Parts
BT1  CR1220 holder  [BATT]
C11  100nF  [0603P]
C17  100nF  [0603P]
C18  100nF  [0603P]
C19  100nF  [0603P]
C23  100nF  [0603P]
C25  100nF  [0603P]
C26  100nF  [0603P]
C32  100nF  [0603P]
C33  100nF  [0603P]
C35  100nF  [0603P]
C36  100nF  [0603P]
C38  100nF  [0603P]
C45  10nF  [0603]
C46  10nF  [0603]
C50  10uF  [TAN-B]
C61  220uF  [C310M]
C69  47uF  [TAN-B]
C81  10uF  [C160M]
C85  100nF  [0603P]
CN17  DC-10B  [DC10B]
JP1  (no value)  [SIP3]
JP12  (no value)  [SIP2]
JP13  (no value)  [2*3P]
L1  BEAD  [0603]
LD5  red  [D0603]
R41  0  [0805]
R42  47  [0805]
R127  300  [0603]
TP3  VREF  [TP]
TP4  5V  [TP]
TP5  3V3  [TP]
TP16  Ground  [TP]
U8  STM32F103ZET6  (part B of 2)
U12  LD1086D2M33  [D2PAK/A]
U15  ZEN056V130A24LS  [polyzen]
U16  BNX002-01  [BNX001]
Z1  SMAJ5.0A-TR  [1R1C]

### Nets
+3V3: C11.1 C69.1 JP1.3 JP12.2(NO) TP5.1 U12.2(Vout)
+5V: C61.1 JP13.1 JP13.3 JP13.5 R127.2 TP4.1 U12.3(Vin)
D5V: JP13.4
E5V: C81.1 JP13.6 U16.3(CV)
GND: BT1.2(-) C11.2 C17.2 C18.2 C19.2 C23.2 C25.2 C26.2 C32.2 C33.2 C35.2 C36.2 C38.2 C45.2 C46.1 C50.2 C61.2 C69.2 C81.2 LD5.2(K) R41.2 TP16.1 U8.16(VSS_5) U8.30(VSSA) U8.38(VSS_4) U8.51(VSS_6) U8.61(VSS_7) U8.71(VSS_1) U8.83(VSS_8) U8.94(VSS_9) U8.107(VSS_2) U8.120(VSS_10) U8.130(VSS_11) U8.143(VSS_3) U12.1(GND) U16.4(CG1) U16.5(CG2) U16.6(CG3)
U5V: JP13.2
Vbat: JP1.2 U8.6(VBAT)
VDD: C17.1 C18.1 C19.1 C23.1 C25.1 C26.1 C32.1 C33.1 C35.1 C36.1 C38.1 JP12.1(COMMON) L1.2 U8.17(VDD_5) U8.39(VDD_4) U8.52(VDD_6) U8.62(VDD_7) U8.72(VDD_1) U8.84(VDD_8) U8.95(VDD_9) U8.108(VDD_2) U8.121(VDD_10) U8.131(VDD_11) U8.144(VDD_3)
VDDA: C46.2 C50.1 L1.1 R42.2 U8.33(VDDA)
VREF+: C45.1 R42.1 TP3.1 U8.32(VREF+)
VREF-: R41.1 U8.31(VREF-)
NetBT1_1: BT1.1(+) JP1.1
NetC85_1: C85.1 U15.3 U16.1(SV) Z1.2(K)
NetC85_2: C85.2 CN17.2(GND) CN17.3(GND) U15.2 U16.2(SG) Z1.1(A)
NetCN17_1: CN17.1(+) U15.1
NetLD5_1: LD5.1(A) R127.1

### Notes on the sheet
- Power regulator
- Jumper for choice between power connector, USB connector or daughter board
- (near JP13) Default setting: 5<->6
- MCU power
- (near JP1) Default setting: 2<->3
- STM3210E-EVAL Power
- MB672
- 10
- 11
- STMicroelectronics
- Title:
- Number:
- Rev:
- Date:
- Sheet       of

### Library data of the parts
BT1 = BATTERY
C11 = Cap: Capacitor; Value: 10nF; Published: 8-Jun-2000; Revision: July-2002: Re-released for DXP Platform.; Publisher: Altium Limited
C17-C19 C23 C25 C26 C32 C33 C35 C36 C38 = CAP: Capacitor; Published: 8-Jun-2000; Revision: July-2002: Re-released for DXP Platform.; Publisher: Altium Limited; Value: 100nF
C45 C46 = Cap: Capacitor; Published: 8-Jun-2000; Revision: July-2002: Re-released for DXP Platform.; Publisher: Altium Limited; Value: 10nF
C50 = Cap Pol1: Polarized Capacitor (Radial); Published: 8-Jun-2000; Revision: July-2002: Re-released for DXP Platform.; Publisher: Altium Limited; Value: 10uF
C61 C69 = Cap Pol1: Polarized Capacitor (Radial); Value: 10uF; Published: 8-Jun-2000; Revision: July-2002: Re-released for DXP Platform.; Publisher: Altium Limited
C81 = Cap Pol1: as C53 on sheet Audio; Published: 8-Jun-2000; Revision: July-2002: Re-released for DXP Platform.; Publisher: Altium Limited
C85 = CAP: Capacitor; Value: 100pF; Published: 8-Jun-2000; Revision: July-2002: Re-released for DXP Platform.; Publisher: Altium Limited
CN17 = PJ202A
JP1 = Jumper3
JP12 = JP2
JP13 = Header 3X2: Header, 3-Pin, Dual row; Revision: 17-Jul-2002: Re-released for DXP Platform.; Publisher: Altium Limited
L1 = Inductor: Value: 100uH; Published: 8-Jun-2000; Revision: July-2002: Re-released for DXP Platform.; Publisher: Altium Limited
LD5 = LED2: as LD1 on sheet Peripherals; Published: 8-Jun-2000; Revision: July-2002: Re-released for DXP Platform.; Publisher: Altium Limited
R41 R42 = Res1: Resistor; Value: 1K; Published: 8-Jun-2000; Revision: July-2002: Re-released for DXP Platform.; Publisher: Altium Limited
R127 = res1: Resistor; Value: 1K; Published: 8-Jun-2000; Revision: July-2002: Re-released for DXP Platform.; Publisher: Altium Limited
TP3-TP5 TP16 = TP
U8 = BigPiranha_new
U12 = VOLTREG1
U16 = BNX002
Z1 = D Schottky: Schottky Diode; Code - JEDEC: DO-214-AA; Published: 8-Jun-2000; Revision: July-2002: Re-released for DXP Platform.; Publisher: Altium Limited

## Sheet JTAG&SWD.SchDoc
size A4; Revision: D.1(PCB.SCH)
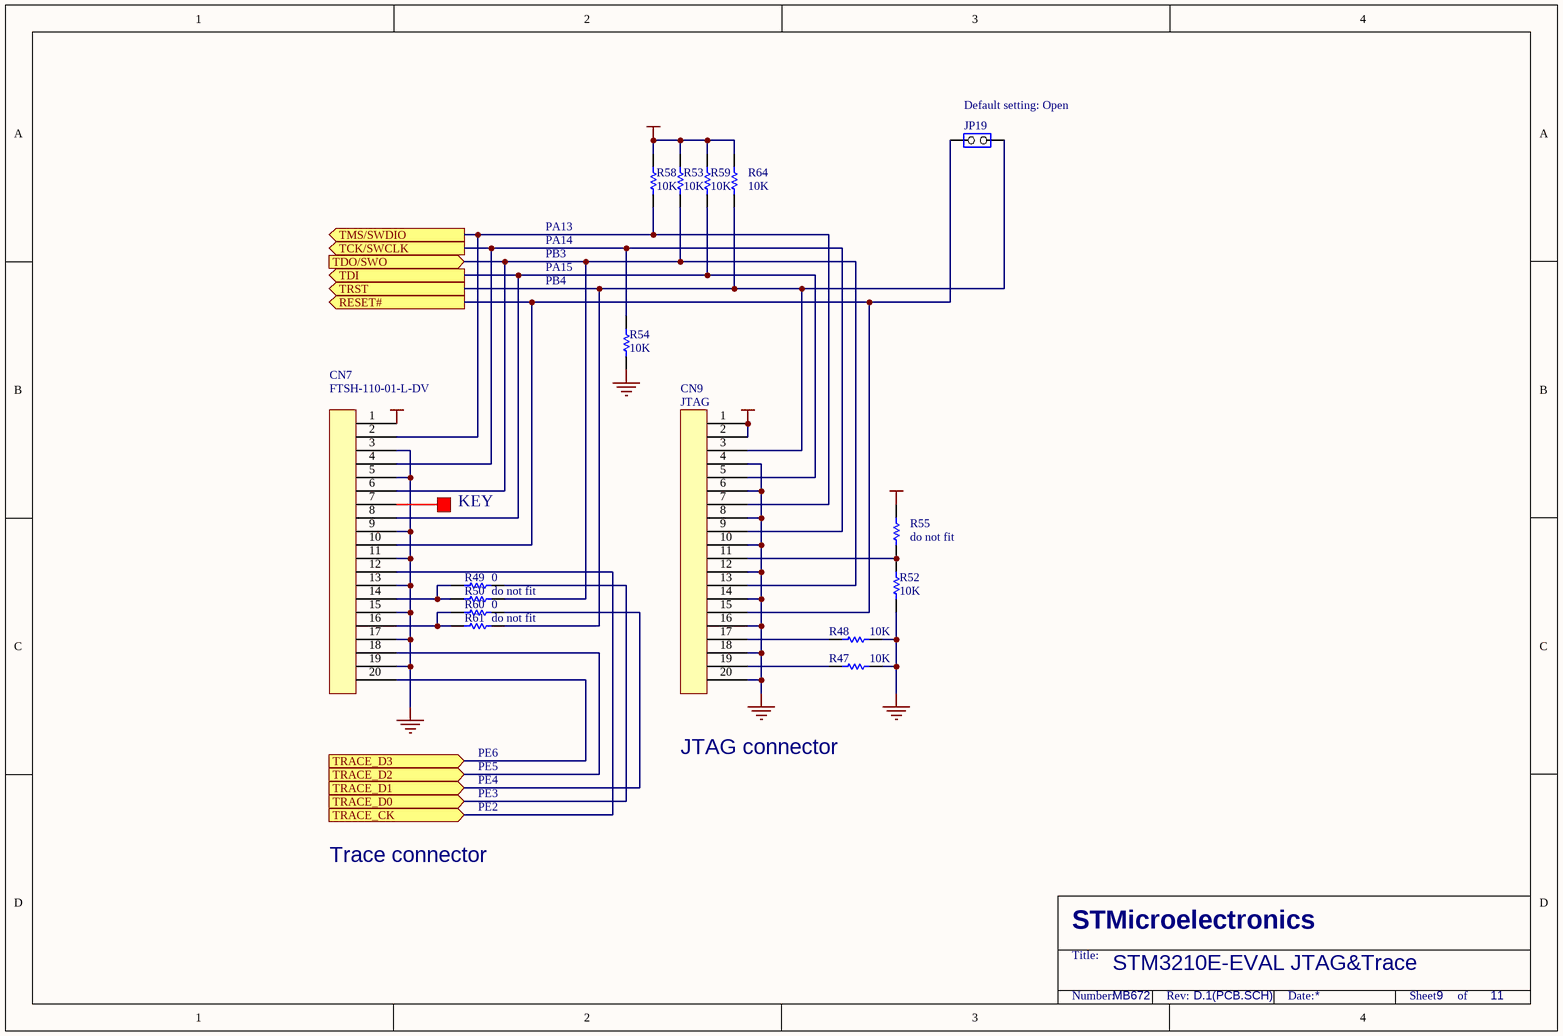
[diagram p7: JTAG&SWD.SchDoc]

### Parts
CN7  FTSH-110-01-L-DV  [IDC20S]
CN9  JTAG  [IDC20S]
JP19  (no value)  [SIP2]
R47  10K  [0603]
R48  10K  [0603]
R49  0  [0603]
R50  do not fit  [0603]
R52  10K  [0603]
R53  10K  [0603]
R54  10K  [0603]
R55  do not fit  [0603]
R58  10K  [0603]
R59  10K  [0603]
R60  0  [0603]
R61  do not fit  [0603]
R64  10K  [0603]

### Ports
RESET# (out), TCK/SWCLK (out), TDI (out), TDO/SWO (in), TMS/SWDIO (out), TRACE_CK (in), TRACE_D0 (in), TRACE_D1 (in), TRACE_D2 (in), TRACE_D3 (in), TRST (out)

### Nets
+3V3: CN7.1 CN9.1 CN9.2 R53.2 R55.2 R58.2 R59.2 R64.2
GND: CN7.3 CN7.5 CN7.9 CN7.11 CN7.13 CN7.15 CN7.17 CN7.19 CN9.4 CN9.6 CN9.8 CN9.10 CN9.12 CN9.14 CN9.16 CN9.18 CN9.20 R47.2 R48.2 R52.1 R54.1
A19: R49.2 ; port TRACE_D0
A20: R60.2 ; port TRACE_D1
A21: CN7.18 ; port TRACE_D2
A22: CN7.20 ; port TRACE_D3
A23: CN7.12 ; port TRACE_CK
PA13: CN7.2 CN9.7 R58.1 ; port TMS/SWDIO
PA14: CN7.4 CN9.9 R54.2 ; port TCK/SWCLK
PA15: CN7.8 CN9.5 R59.1 ; port TDI
PB3: CN7.6 CN9.13 R50.2 R53.1 ; port TDO/SWO
PB4: CN9.3 JP19.1(COMMON) R61.2 R64.1 ; port TRST
RESET#: CN7.10 CN9.15 JP19.2(NO) ; port RESET#
NetCN7_14: CN7.14 R49.1 R50.1
NetCN7_16: CN7.16 R60.1 R61.1
NetCN9_11: CN9.11 R52.2 R55.1
NetCN9_17: CN9.17 R48.1
NetCN9_19: CN9.19 R47.1

Not connected (* = marked no-connect by the designer): CN7 7

### Notes on the sheet
- (near JP19) Default setting: Open
- PA14
- PA13
- PB4
- PB3
- PA15
- KEY
- PE4
- PE5
- PE6
- JTAG connector
- PE2
- PE3
- Trace connector
- STM3210E-EVAL JTAG&Trace
- MB672
- 9
- 11
- STMicroelectronics
- Title:
- Number:
- Rev:
- Date:
- Sheet       of

### Library data of the parts
CN7 CN9 = 20PIN1
JP19 = JP2
R47-R50 R52-R55 R58-R61 R64 = Res1: Resistor; Value: 1K; Published: 8-Jun-2000; Revision: July-2002: Re-released for DXP Platform.; Publisher: Altium Limited

## Sheet MCU.SchDoc
size A3; Revision: D.1(PCB.SCH)
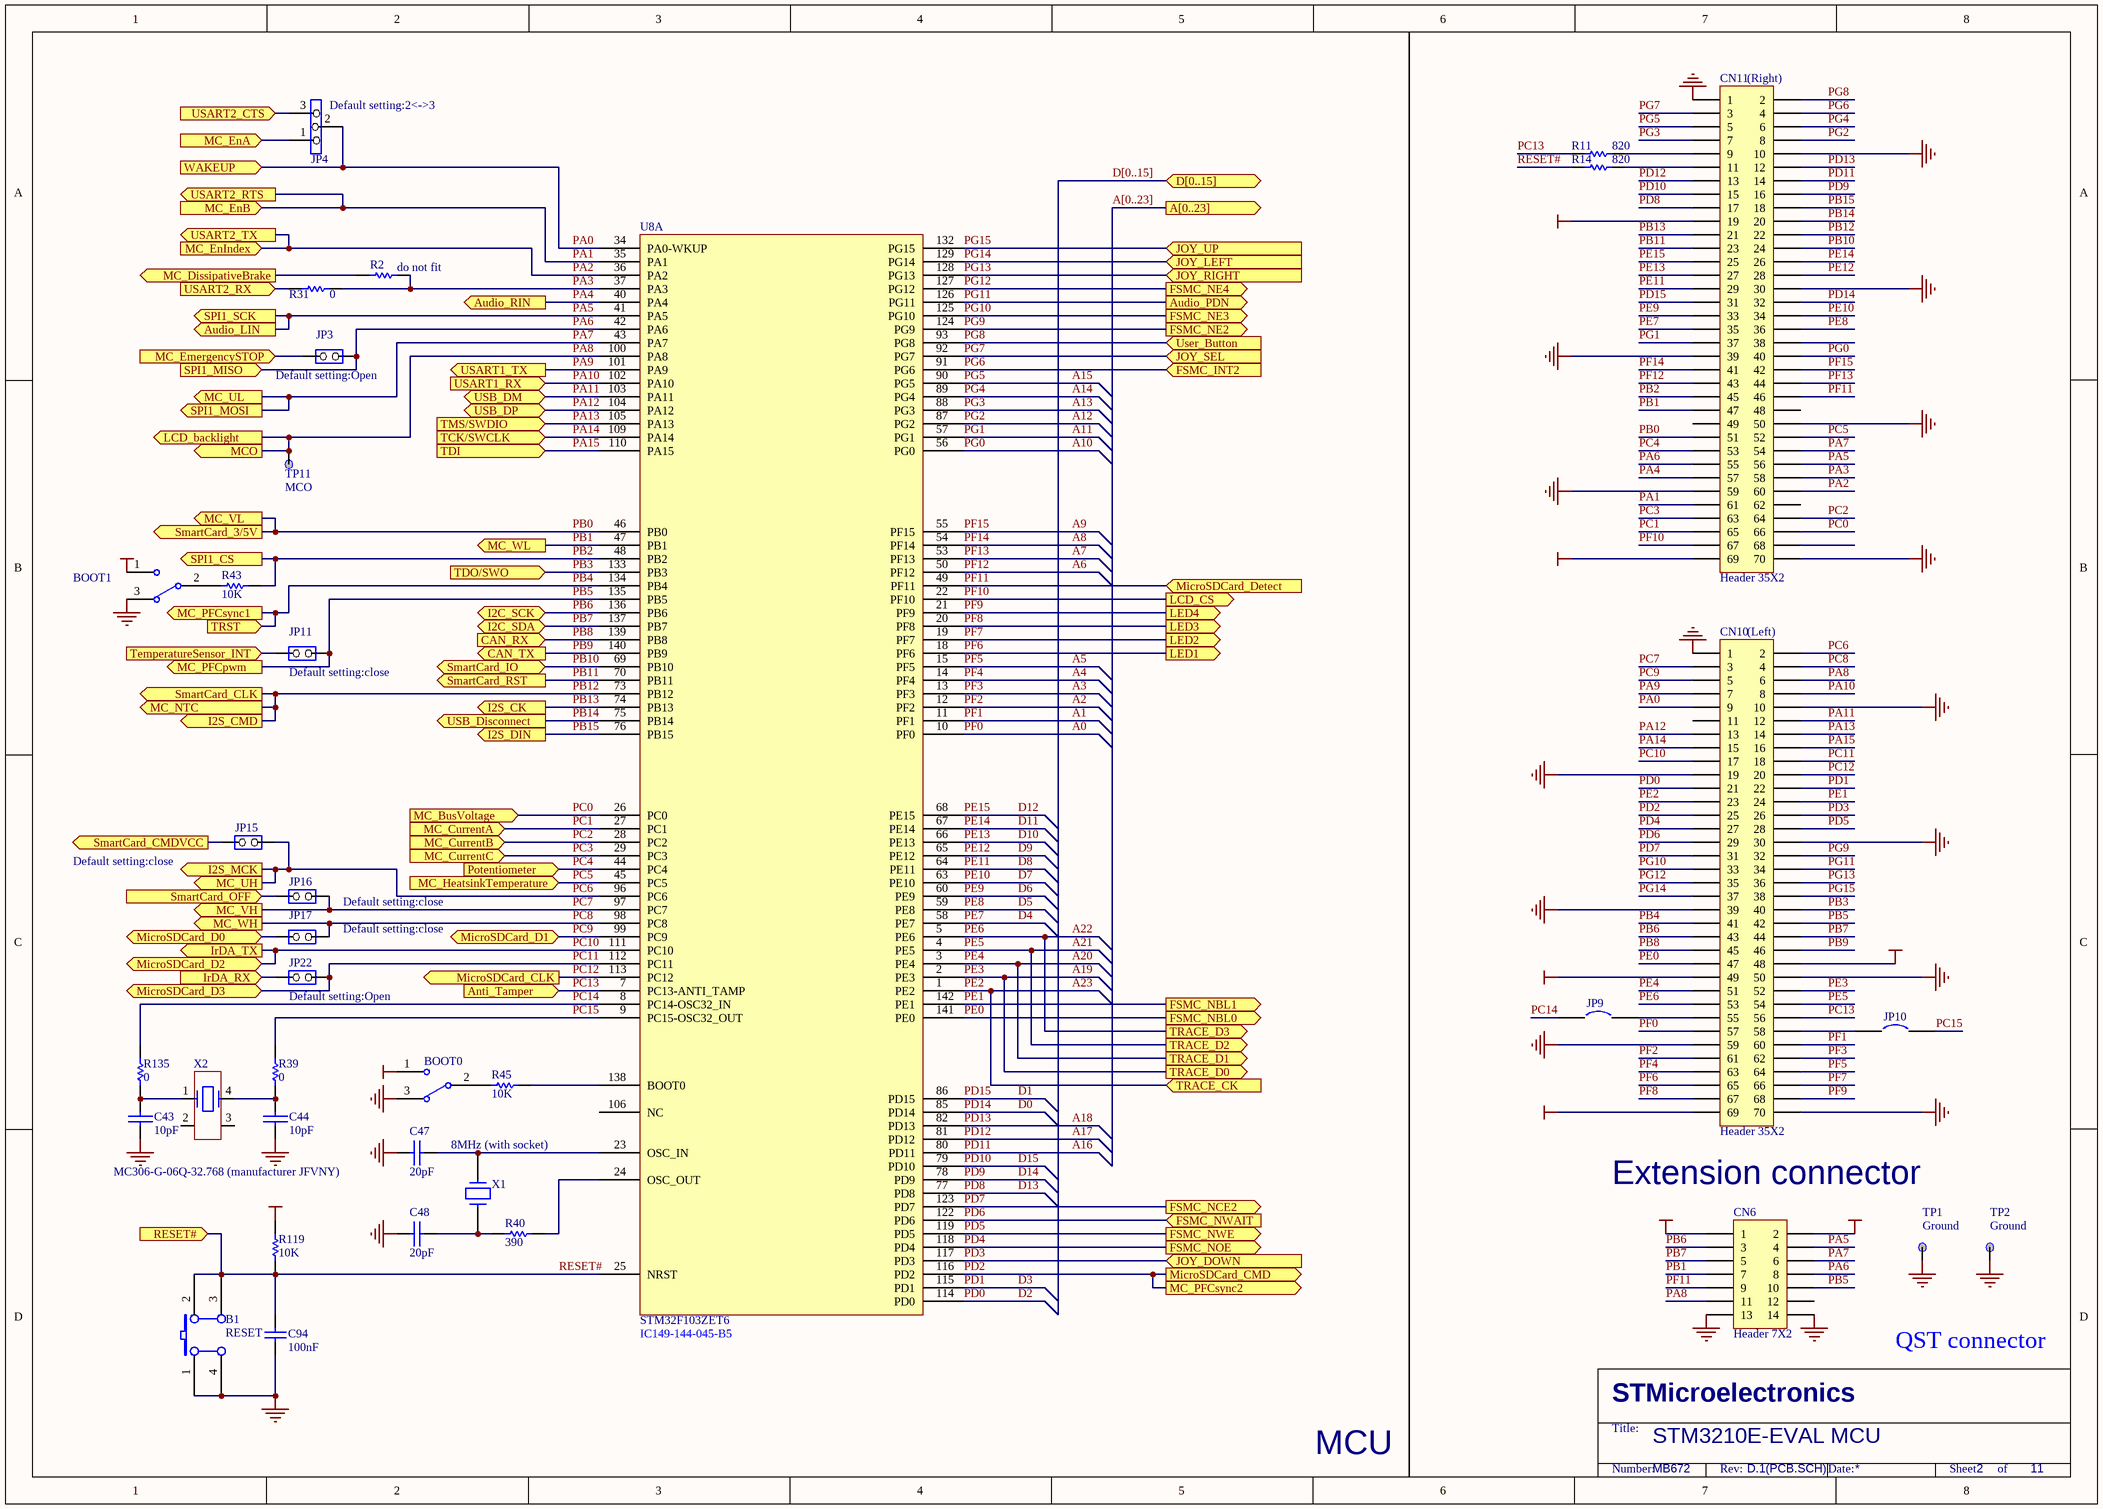
[diagram p8: MCU.SchDoc]

### Parts
B1  RESET  [PB10]
BOOT0  (no value)  [SIP3]
BOOT1  (no value)  [SIP3]
C43  10pF  [0603]
C44  10pF  [0603]
C47  20pF  [0603]
C48  20pF  [0603]
C94  100nF  [0603P]
CN6  Header 7X2  [HDR2X7]
CN10  Header 35X2
CN11  Header 35X2
JP3  (no value)  [SIP2]
JP4  (no value)  [SIP3]
JP9  (no value)  [SPST-2]
JP10  (no value)  [SPST-2]
JP11  (no value)  [SIP2]
JP15  (no value)  [SIP2]
JP16  (no value)  [SIP2]
JP17  (no value)  [SIP2]
JP22  (no value)  [SIP2]
R2  do not fit  [0603]
R11  820  [0603]
R14  820  [0603]
R31  0  [0603]
R39  0  [0805]
R40  390  [0603]
R43  10K  [0603]
R45  10K  [0603]
R119  10K  [0603]
R135  0  [0805]
TP1  Ground  [TP]
TP2  Ground  [TP]
TP11  MCO  [TP]
U8  STM32F103ZET6  (part A of 2)
X1  8MHz (with socket)  [XTAL1]
X2  MC306-G-06Q-32.768 (manufacturer JFVNY)  [SM8]

### Ports
A[0..23] (out), Anti_Tamper (in), Audio_LIN (out), Audio_PDN (out), Audio_RIN (out), CAN_RX (in), CAN_TX (out), D[0..15] (bidir), FSMC_INT2 (in), FSMC_NBL0 (out), FSMC_NBL1 (out), FSMC_NCE2 (out), FSMC_NE2 (out), FSMC_NE3 (out), FSMC_NE4 (out), FSMC_NOE (out), FSMC_NWAIT (in), FSMC_NWE (out), I2C_SCK (bidir), I2C_SDA (bidir), I2S_CK (out), I2S_CMD (out), I2S_DIN (out), I2S_MCK (out), IrDA_RX (in), IrDA_TX (out), JOY_DOWN (in), JOY_LEFT (in), JOY_RIGHT (in), JOY_SEL (in), JOY_UP (in), LCD_backlight (out), LCD_CS (out), LED1 (out), LED2 (out), LED3 (out), LED4 (out), MC_BusVoltage (in), MC_CurrentA (in), MC_CurrentB (in), MC_CurrentC (in), MC_DissipativeBrake (out), MC_EmergencySTOP (in), MC_EnA (in), MC_EnB (in), MC_EnIndex (in), MC_HeatsinkTemperature (in), MC_NTC (out), MC_PFCpwm (out), MC_PFCsync1 (out), MC_PFCsync2 (out), MC_UH (out), MC_UL (out), MC_VH (out), MC_VL (out), MC_WH (out), MC_WL (out), MCO (out), MicroSDCard_CLK (out), MicroSDCard_CMD (out), MicroSDCard_D0 (bidir), MicroSDCard_D1 (bidir), MicroSDCard_D2 (bidir), MicroSDCard_D3 (bidir), MicroSDCard_Detect (in), Potentiometer (in), RESET# (in), SmartCard_3/5V (out), SmartCard_CLK (out), SmartCard_CMDVCC (out), SmartCard_IO (bidir), SmartCard_OFF (in), SmartCard_RST (out), SPI1_CS (out), SPI1_MISO (in), SPI1_MOSI (out), SPI1_SCK (out), TCK/SWCLK (in), TDI (in), TDO/SWO (in), TemperatureSensor_INT (in), TMS/SWDIO (in), TRACE_CK (in), TRACE_D0 (out), TRACE_D1 (out), TRACE_D2 (out), TRACE_D3 (out), TRST (in), USART1_RX (in), USART1_TX (out), USART2_CTS (in), USART2_RTS (out), USART2_RX (in), USART2_TX (out), USB_Disconnect (out), USB_DM (bidir), USB_DP (bidir), User_Button (in), WAKEUP (in)

### Nets
+3V3: BOOT0.1 BOOT1.1 CN10.48 CN10.69 CN11.69 R119.2
+5V: CN6.1 CN6.2
D5V: CN10.49 CN11.19
GND: B1.1(A0) B1.4(A1) BOOT0.3 BOOT1.3 C43.2 C44.2 C47.2 C48.2 C94.1 CN6.13 CN6.14 CN10.1 CN10.10 CN10.19 CN10.30 CN10.39 CN10.50 CN10.59 CN10.70 CN11.1 CN11.10 CN11.30 CN11.39 CN11.50 CN11.59 CN11.70 TP1.1 TP2.1
A0: CN10.57 U8.10(PF0)  [also labelled PF0]
A1: CN10.60 U8.11(PF1)  [also labelled PF1]
A2: CN10.61 U8.12(PF2)  [also labelled PF2]
A3: CN10.62 U8.13(PF3)  [also labelled PF3]
A4: CN10.63 U8.14(PF4)  [also labelled PF4]
A5: CN10.64 U8.15(PF5)  [also labelled PF5]
A6: CN11.43 U8.50(PF12)  [also labelled PF12]
A7: CN11.44 U8.53(PF13)  [also labelled PF13]
A8: CN11.41 U8.54(PF14)  [also labelled PF14]
A9: CN11.42 U8.55(PF15)  [also labelled PF15]
A10: CN11.40 U8.56(PG0)  [also labelled PG0]
A11: CN11.37 U8.57(PG1)  [also labelled PG1]
A12: CN11.8 U8.87(PG2)  [also labelled PG2]
A13: CN11.7 U8.88(PG3)  [also labelled PG3]
A14: CN11.6 U8.89(PG4)  [also labelled PG4]
A15: CN11.5 U8.90(PG5)  [also labelled PG5]
A16: CN11.14 U8.80(PD11)  [also labelled PD11]
A17: CN11.13 U8.81(PD12)  [also labelled PD12]
A18: CN11.12 U8.82(PD13)  [also labelled PD13]
A19: CN10.52 U8.2(PE3) ; port TRACE_D0  [also labelled PE3]
A20: CN10.51 U8.3(PE4) ; port TRACE_D1  [also labelled PE4]
A21: CN10.54 U8.4(PE5) ; port TRACE_D2  [also labelled PE5]
A22: CN10.53 U8.5(PE6) ; port TRACE_D3  [also labelled PE6]
A23: CN10.23 U8.1(PE2) ; port TRACE_CK  [also labelled PE2]
D0: CN11.32 U8.85(PD14)  [also labelled PD14]
D1: CN11.31 U8.86(PD15)  [also labelled PD15]
D2: CN10.21 U8.114(PD0)  [also labelled PD0]
D3: CN10.22 U8.115(PD1)  [also labelled PD1]
D4: CN11.35 U8.58(PE7)  [also labelled PE7]
D5: CN11.36 U8.59(PE8)  [also labelled PE8]
D6: CN11.33 U8.60(PE9)  [also labelled PE9]
D7: CN11.34 U8.63(PE10)  [also labelled PE10]
D8: CN11.29 U8.64(PE11)  [also labelled PE11]
D9: CN11.28 U8.65(PE12)  [also labelled PE12]
D10: CN11.27 U8.66(PE13)  [also labelled PE13]
D11: CN11.26 U8.67(PE14)  [also labelled PE14]
D12: CN11.25 U8.68(PE15)  [also labelled PE15]
D13: CN11.17 U8.77(PD8)  [also labelled PD8]
D14: CN11.16 U8.78(PD9)  [also labelled PD9]
D15: CN11.15 U8.79(PD10)  [also labelled PD10]
PA0: CN10.9 JP4.2 U8.34(PA0-WKUP) ; port WAKEUP
PA1: CN11.61 U8.35(PA1) ; port USART2_RTS, port MC_EnB
PA2: CN11.60 U8.36(PA2) ; port USART2_TX, port MC_EnIndex
PA3: CN11.58 R2.1 R31.1 U8.37(PA3)
PA4: CN11.57 U8.40(PA4) ; port Audio_RIN
PA5: CN6.4 CN11.56 U8.41(PA5) ; port SPI1_SCK, port Audio_LIN
PA6: CN6.8 CN11.55 JP3.1(COMMON) U8.42(PA6) ; port SPI1_MISO
PA7: CN6.6 CN11.54 U8.43(PA7) ; port MC_UL, port SPI1_MOSI
PA8: CN6.11 CN10.6 TP11.1 U8.100(PA8) ; port LCD_backlight, port MCO
PA9: CN10.7 U8.101(PA9) ; port USART1_TX
PA10: CN10.8 U8.102(PA10) ; port USART1_RX
PA11: CN10.12 U8.103(PA11) ; port USB_DM
PA12: CN10.13 U8.104(PA12) ; port USB_DP
PA13: CN10.14 U8.105(PA13) ; port TMS/SWDIO
PA14: CN10.15 U8.109(PA14) ; port TCK/SWCLK
PA15: CN10.16 U8.110(PA15) ; port TDI
PB0: CN11.51 U8.46(PB0) ; port MC_VL, port SmartCard_3/5V
PB1: CN6.7 CN11.47 U8.47(PB1) ; port MC_WL
PB2: CN11.45 R43.1 U8.48(PB2) ; port SPI1_CS
PB3: CN10.40 U8.133(PB3) ; port TDO/SWO
PB4: CN10.41 U8.134(PB4) ; port TRST, port MC_PFCsync1
PB5: CN6.10 CN10.42 JP11.1(COMMON) U8.135(PB5) ; port MC_PFCpwm
PB6: CN6.3 CN10.43 U8.136(PB6) ; port I2C_SCK
PB7: CN6.5 CN10.44 U8.137(PB7) ; port I2C_SDA
PB8: CN10.45 U8.139(PB8) ; port CAN_RX
PB9: CN10.46 U8.140(PB9) ; port CAN_TX
PB10: CN11.24 U8.69(PB10) ; port SmartCard_IO
PB11: CN11.23 U8.70(PB11) ; port SmartCard_RST
PB12: CN11.22 U8.73(PB12) ; port I2S_CMD, port MC_NTC, port SmartCard_CLK
PB13: CN11.21 U8.74(PB13) ; port I2S_CK
PB14: CN11.20 U8.75(PB14) ; port USB_Disconnect
PB15: CN11.18 U8.76(PB15) ; port I2S_DIN
PC0: CN11.66 U8.26(PC0) ; port MC_BusVoltage
PC1: CN11.65 U8.27(PC1) ; port MC_CurrentA
PC2: CN11.64 U8.28(PC2) ; port MC_CurrentB
PC3: CN11.63 U8.29(PC3) ; port MC_CurrentC
PC4: CN11.53 U8.44(PC4) ; port Potentiometer
PC5: CN11.52 U8.45(PC5) ; port MC_HeatsinkTemperature
PC6: CN10.2 JP15.1(COMMON) U8.96(PC6) ; port MC_UH, port I2S_MCK
PC7: CN10.3 JP16.1(COMMON) U8.97(PC7) ; port MC_VH
PC8: CN10.4 JP17.1(COMMON) U8.98(PC8) ; port MC_WH
PC9: CN10.5 U8.99(PC9) ; port MicroSDCard_D1
PC10: CN10.17 U8.111(PC10) ; port IrDA_TX, port MicroSDCard_D2
PC11: CN10.18 JP22.1(COMMON) U8.112(PC11) ; port MicroSDCard_D3
PC12: CN10.20 U8.113(PC12) ; port MicroSDCard_CLK
PC13: CN10.56 R11.1 U8.7(PC13-ANTI_TAMP) ; port Anti_Tamper
PC14: JP9.1 R135.2 U8.8(PC14-OSC32_IN)
PC15: JP10.2 R39.2 U8.9(PC15-OSC32_OUT)
PD2: CN10.25 U8.116(PD2) ; port MC_PFCsync2, port MicroSDCard_CMD
PD3: CN10.26 U8.117(PD3) ; port JOY_DOWN
PD4: CN10.27 U8.118(PD4) ; port FSMC_NOE
PD5: CN10.28 U8.119(PD5) ; port FSMC_NWE
PD6: CN10.29 U8.122(PD6) ; port FSMC_NWAIT
PD7: CN10.31 U8.123(PD7) ; port FSMC_NCE2
PE0: CN10.47 U8.141(PE0) ; port FSMC_NBL0
PE1: CN10.24 U8.142(PE1) ; port FSMC_NBL1
PF6: CN10.65 U8.18(PF6) ; port LED1
PF7: CN10.66 U8.19(PF7) ; port LED2
PF8: CN10.67 U8.20(PF8) ; port LED3
PF9: CN10.68 U8.21(PF9) ; port LED4
PF10: CN11.67 U8.22(PF10) ; port LCD_CS
PF11: CN6.9 CN11.46 U8.49(PF11) ; port MicroSDCard_Detect
PG6: CN11.4 U8.91(PG6) ; port FSMC_INT2
PG7: CN11.3 U8.92(PG7) ; port JOY_SEL
PG8: CN11.2 U8.93(PG8) ; port User_Button
PG9: CN10.32 U8.124(PG9) ; port FSMC_NE2
PG10: CN10.33 U8.125(PG10) ; port FSMC_NE3
PG11: CN10.34 U8.126(PG11) ; port Audio_PDN
PG12: CN10.35 U8.127(PG12) ; port FSMC_NE4
PG13: CN10.36 U8.128(PG13) ; port JOY_RIGHT
PG14: CN10.37 U8.129(PG14) ; port JOY_LEFT
PG15: CN10.38 U8.132(PG15) ; port JOY_UP
RESET#: B1.2(B0) B1.3(B1) C94.2 R14.2 R119.1 U8.25(NRST) ; port RESET#
NetBOOT0_2: BOOT0.2 R45.2
NetBOOT1_2: BOOT1.2 R43.2
NetC1_2: JP4.1 ; port MC_EnA
NetC43_1: C43.1 R135.1 X2.1
NetC44_1: C44.1 R39.1 X2.4
NetC47_1: C47.1 U8.23(OSC_IN) X1.2
NetC48_1: C48.1 R40.2 X1.1
NetCN1_23: R2.2 ; port MC_DissipativeBrake
NetCN10_55: CN10.55 JP9.2
NetCN10_58: CN10.58 JP10.1
NetCN11_9: CN11.9 R11.2
NetCN11_11: CN11.11 R14.1
NetCN13_7: JP17.2(NO) ; port MicroSDCard_D0
NetJP3_2: JP3.2(NO) ; port MC_EmergencySTOP
NetJP4_3: JP4.3 ; port USART2_CTS
NetJP11_2: JP11.2(NO) ; port TemperatureSensor_INT
NetJP15_2: JP15.2(NO) ; port SmartCard_CMDVCC
NetJP16_2: JP16.2(NO) ; port SmartCard_OFF
NetJP22_2: JP22.2(NO) ; port IrDA_RX
NetR29_2: R31.2 ; port USART2_RX
NetR40_1: R40.1 U8.24(OSC_OUT)
NetR45_1: R45.1 U8.138(BOOT0)

Not connected (* = marked no-connect by the designer): CN6 12; CN10 11; CN11 38 48 49 62 68; U8 106(NC); X2 2 3

### Buses and harness runs
bus A[0..23] = port A[0..23]
bus D[0..15] = port D[0..15]

### Notes on the sheet
- (near JP4) Default setting:2<->3
- (near CN11) (Right)
- (near JP3) Default setting:Open
- (near CN10) (Left)
- (near JP11) Default setting:close
- (near JP15) Default setting:close
- Default setting:close
- (near JP22) Default setting:Open
- Extension connector
- (near U8) IC149-144-045-B5
- QST connector
- MCU
- STM3210E-EVAL MCU
- MB672
- 2
- 11
- STMicroelectronics
- Title:
- Number:
- Rev:
- Date:
- Sheet       of

### Library data of the parts
B1 = SW PUSHBUTTON: SE PUSHBUTTON
BOOT0 BOOT1 = SW-SPDT: SPDT Subminiature Toggle Switch, Right Angle Mounting, Vertical Actuation; Revision 1: Jul-2002: Re-released for DXP Platform.; Revision 2: 17-Dec-2003: Schematic revised, PCB Footprint replaced.; Published: 24-Mar-1999; Datasheet: Latest Revision: 05-Dec-2000; Publisher: Altium Limited
C43 C44 C47 C48 = CAP: Capacitor
C94 = CAP: Capacitor; Value: 100pF; Published: 8-Jun-2000; Revision: July-2002: Re-released for DXP Platform.; Publisher: Altium Limited
CN6 = Header 7X2: Header, 7-Pin, Dual row; Revision: 17-Jul-2002: Re-released for DXP Platform.; Publisher: Altium Limited
CN10 CN11 = Header35X2
JP3 JP11 JP15-JP17 JP22 = JP2
JP4 = Jumper3
JP9 JP10 = Circuit Breaker: Published: 24-Mar-1999; Revision: July-2002: Re-released for DXP Platform.; Publisher: Altium Limited
R2 R31 R43 R45 R119 = res1: Resistor; Value: 1K; Published: 8-Jun-2000; Revision: July-2002: Re-released for DXP Platform.; Publisher: Altium Limited
R11 R14 R39 R40 R135 = Res1: Resistor; Value: 1K; Published: 8-Jun-2000; Revision: July-2002: Re-released for DXP Platform.; Publisher: Altium Limited
TP1 TP2 TP11 = TP
U8 = BigPiranha_new
X1 = CRYSTAL
X2 = MC306